# EAGLE design untitled (EAGLE 9.6.2)
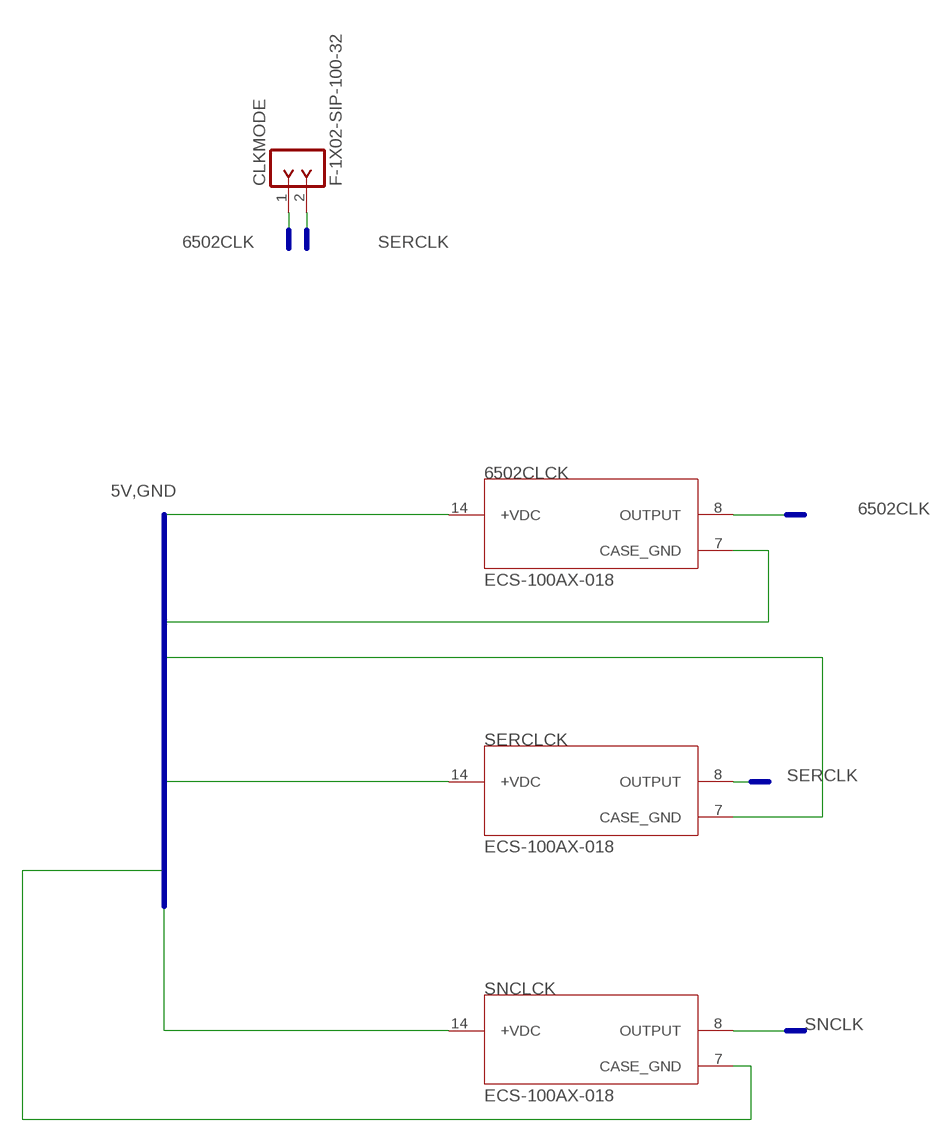
[diagram p0: schematic, sheet 1, part 1 of 3]
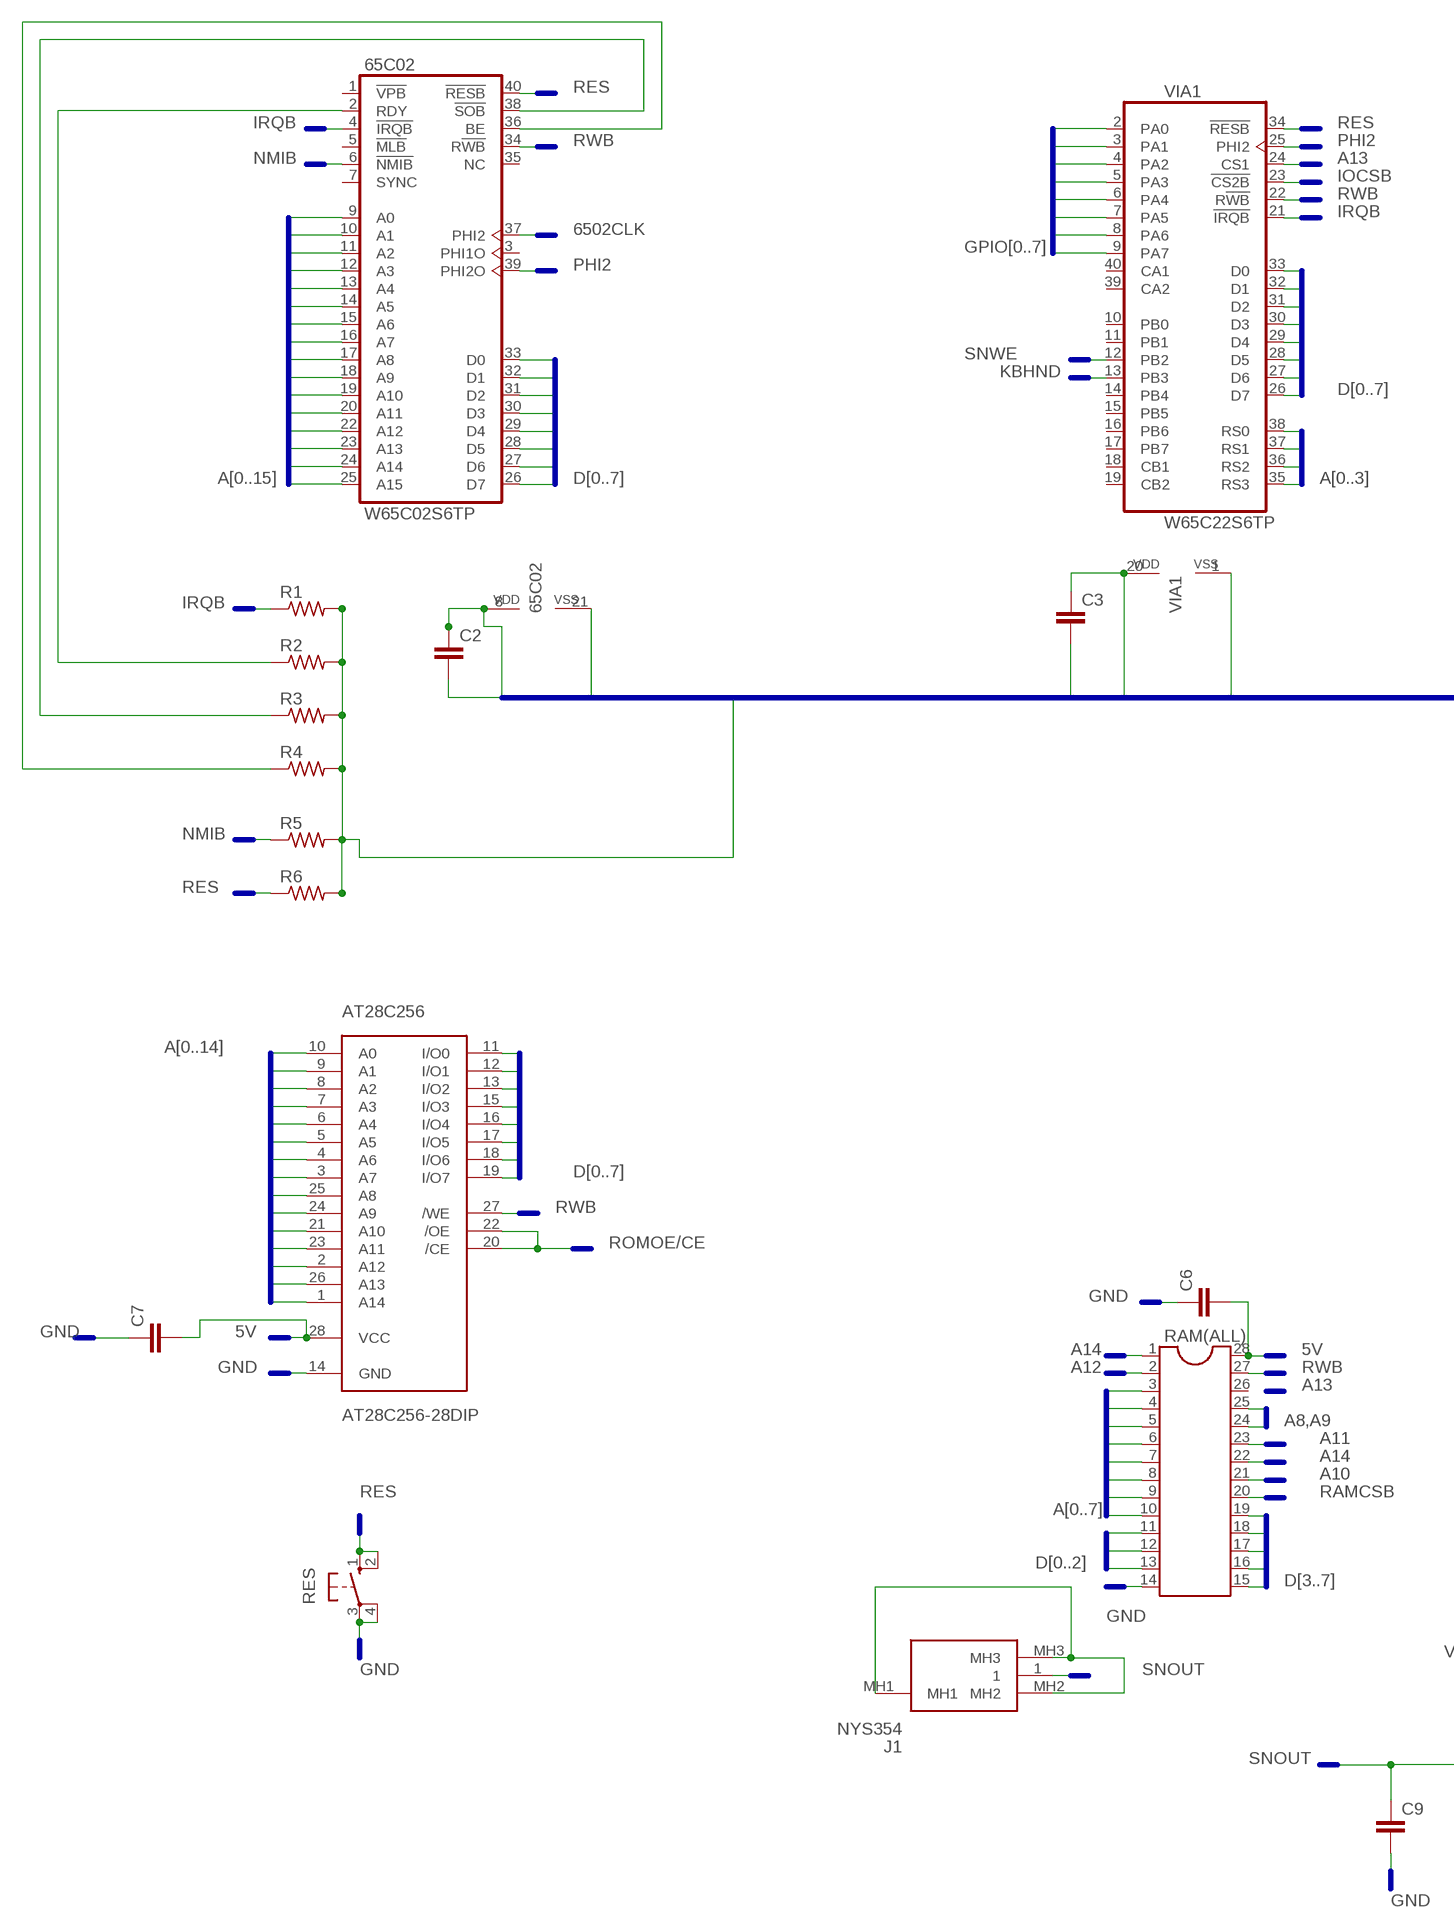
[diagram p1: schematic, sheet 1, part 2 of 3]
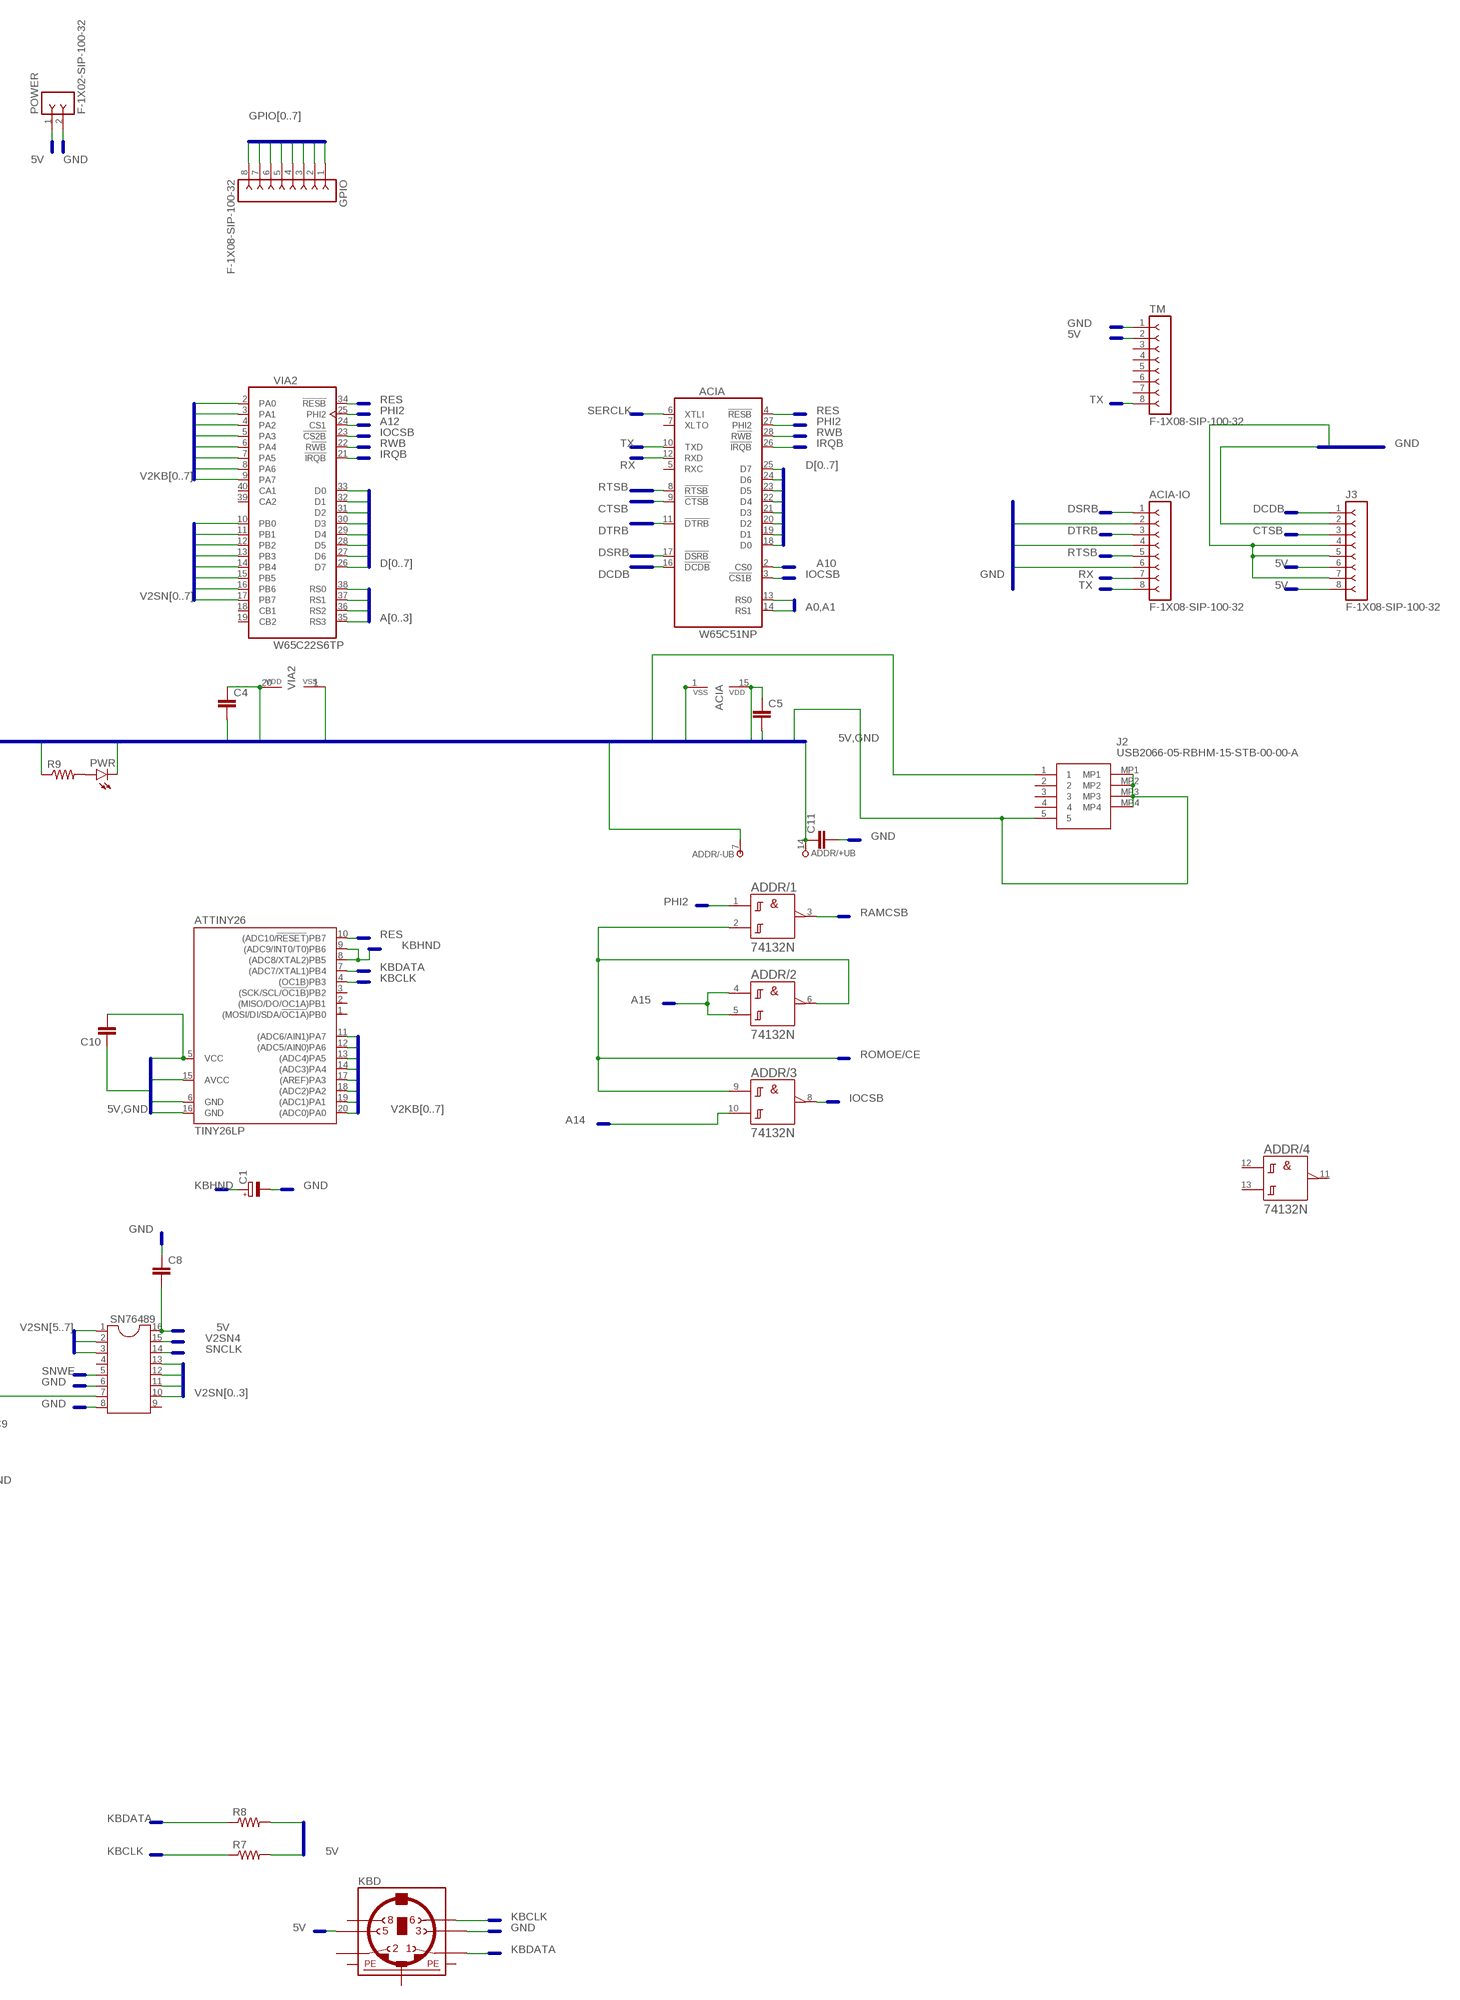
[diagram p2: schematic, sheet 1, part 3 of 3]

## Parts
65C02  W65C02S6TP  [DIL40]
6502CLCK  ECS-100AX-018  [OSC_ECS-100AX-018]
ACIA  W65C51NP  [DIL28-6]
ACIA-IO  F-1X08-SIP-100-32  [SIP-100-08-32]
ADDR  74132N  [DIL14]
AT28C256  AT28C256-28DIP  [DIL28-6]
ATTINY26  TINY26LP  [DIL20]
C1  CPOL-EUE2,5-6E  [E2,5-6E]
C2  C-EU025-024X044  [C025-024X044]
C3  C-EU025-024X044  [C025-024X044]
C4  C-EU025-024X044  [C025-024X044]
C5  C-EU025-024X044  [C025-024X044]
C6  C-EU025-024X044  [C025-024X044]
C7  C-EU025-024X044  [C025-024X044]
C8  C-EU025-024X044  [C025-024X044]
C9  C-EU025-024X044  [C025-024X044]
C10  C-EU025-024X044  [C025-024X044]
C11  C-EU025-024X044  [C025-024X044]
CLKMODE  F-1X02-SIP-100-32  [SIP-100-02-32]
GPIO  F-1X08-SIP-100-32  [SIP-100-08-32]
J1  NYS354  [NYS354]
J2  USB2066-05-RBHM-15-STB-00-00-A  [USB206605RBHM15STB0000A]
J3  F-1X08-SIP-100-32  [SIP-100-08-32]
KBD  MINI_DIN_6  [M_DIN6]
POWER  F-1X02-SIP-100-32  [SIP-100-02-32]
PWR  LED5MM  [LED5MM]
R1  R-US_0204/7  [0204/7]
R2  R-US_0204/7  [0204/7]
R3  R-US_0204/7  [0204/7]
R4  R-US_0204/7  [0204/7]
R5  R-US_0204/7  [0204/7]
R6  R-US_0204/7  [0204/7]
R7  R-US_0204/7  [0204/7]
R8  R-US_0204/7  [0204/7]
R9  R-US_0204/7  [0204/7]
RAM(ALL)  DIL28  [DIL28-6]
RES  10-XX  [B3F-10XX]
SERCLCK  ECS-100AX-018  [OSC_ECS-100AX-018]
SN76489  DIL16  [DIL16]
SNCLCK  ECS-100AX-018  [OSC_ECS-100AX-018]
TM  F-1X08-SIP-100-32  [SIP-100-08-32]
VIA1  W65C22S6TP  [DIL40]
VIA2  W65C22S6TP  [DIL40]

## Nets
5V: 65C02.8(P:VDD) 6502CLCK.14(+VDC) ACIA.15(VDD) ADDR.14(/+UB:+UB) AT28C256.28(VCC) ATTINY26.5(VCC) ATTINY26.15(AVCC) C2.1 C3.1 C4.1 C5.1 C6.2 C7.2 C8.2 C10.2 C11.1 J2.1 J3.6 J3.8 KBD.5 POWER.1 R1.2 R2.2 R3.2 R4.2 R5.2 R6.2 R7.2 R8.2 R9.1 RAM(ALL).28 SERCLCK.14(+VDC) SN76489.16 SNCLCK.14(+VDC) TM.2 VIA1.20(VIAP:VDD) VIA2.20(VIAP:VDD)
6502CLK: 65C02.37(1:PHI2) 6502CLCK.8(OUTPUT) CLKMODE.1
A0: 65C02.9(1:A0) ACIA.13(RS0) AT28C256.10(A0) RAM(ALL).10 VIA1.38(VIA:RS0) VIA2.38(VIA:RS0)
A1: 65C02.10(1:A1) ACIA.14(RS1) AT28C256.9(A1) RAM(ALL).9 VIA1.37(VIA:RS1) VIA2.37(VIA:RS1)
A2: 65C02.11(1:A2) AT28C256.8(A2) RAM(ALL).8 VIA1.36(VIA:RS2) VIA2.36(VIA:RS2)
A3: 65C02.12(1:A3) AT28C256.7(A3) RAM(ALL).7 VIA1.35(VIA:RS3) VIA2.35(VIA:RS3)
A4: 65C02.13(1:A4) AT28C256.6(A4) RAM(ALL).6
A5: 65C02.14(1:A5) AT28C256.5(A5) RAM(ALL).5
A6: 65C02.15(1:A6) AT28C256.4(A6) RAM(ALL).4
A7: 65C02.16(1:A7) AT28C256.3(A7) RAM(ALL).3
A8: 65C02.17(1:A8) AT28C256.25(A8) RAM(ALL).25
A9: 65C02.18(1:A9) AT28C256.24(A9) RAM(ALL).24
A10: 65C02.19(1:A10) ACIA.2(CS0) AT28C256.21(A10) RAM(ALL).21
A11: 65C02.20(1:A11) AT28C256.23(A11) RAM(ALL).23
A12: 65C02.22(1:A12) AT28C256.2(A12) RAM(ALL).2 VIA2.24(VIA:CS1)
A13: 65C02.23(1:A13) AT28C256.26(A13) VIA1.24(VIA:CS1)
A14: 65C02.24(1:A14) ADDR.10(/3:B) AT28C256.1(A14) RAM(ALL).1 RAM(ALL).22
A15: 65C02.25(1:A15) ADDR.4(/2:A) ADDR.5(/2:B)
CTSB: ACIA.9(!CTSB) J3.3
D0: 65C02.33(1:D0) ACIA.18(D0) AT28C256.11(I/O0) RAM(ALL).11 VIA1.33(VIA:D0) VIA2.33(VIA:D0)
D1: 65C02.32(1:D1) ACIA.19(D1) AT28C256.12(I/O1) RAM(ALL).12 VIA1.32(VIA:D1) VIA2.32(VIA:D1)
D2: 65C02.31(1:D2) ACIA.20(D2) AT28C256.13(I/O2) RAM(ALL).13 VIA1.31(VIA:D2) VIA2.31(VIA:D2)
D3: 65C02.30(1:D3) ACIA.21(D3) AT28C256.15(I/O3) RAM(ALL).15 VIA1.30(VIA:D3) VIA2.30(VIA:D3)
D4: 65C02.29(1:D4) ACIA.22(D4) AT28C256.16(I/O4) RAM(ALL).16 VIA1.29(VIA:D4) VIA2.29(VIA:D4)
D5: 65C02.28(1:D5) ACIA.23(D5) AT28C256.17(I/O5) RAM(ALL).17 VIA1.28(VIA:D5) VIA2.28(VIA:D5)
D6: 65C02.27(1:D6) ACIA.24(D6) AT28C256.18(I/O6) RAM(ALL).18 VIA1.27(VIA:D6) VIA2.27(VIA:D6)
D7: 65C02.26(1:D7) ACIA.25(D7) AT28C256.19(I/O7) RAM(ALL).19 VIA1.26(VIA:D7) VIA2.26(VIA:D7)
DCDB: ACIA.16(!DCDB) J3.1
DSRB: ACIA-IO.1 ACIA.17(!DSRB)
DTRB: ACIA-IO.3 ACIA.11(!DTRB)
GND: 65C02.21(P:VSS) 6502CLCK.7(CASE_GND) ACIA-IO.2 ACIA-IO.4 ACIA-IO.6 ACIA.1(VSS) ADDR.7(/-UB:-UB) AT28C256.14(GND) ATTINY26.6(GND) ATTINY26.16(GND) C1.- C2.2 C3.2 C4.2 C5.2 C6.1 C7.1 C8.1 C9.2 C10.1 C11.2 J2.5 J2.MP1 J2.MP2 J2.MP3 J2.MP4 J3.2 J3.4 J3.5 J3.7 KBD.3 POWER.2 PWR.K(C) RAM(ALL).14 RES.3(P) RES.4(P1) SERCLCK.7(CASE_GND) SN76489.6 SN76489.8 SNCLCK.7(CASE_GND) TM.1 VIA1.1(VIAP:VSS) VIA2.1(VIAP:VSS)
GPIO0: GPIO.1 VIA1.2(VIA:PA0)
GPIO1: GPIO.2 VIA1.3(VIA:PA1)
GPIO2: GPIO.3 VIA1.4(VIA:PA2)
GPIO3: GPIO.4 VIA1.5(VIA:PA3)
GPIO4: GPIO.5 VIA1.6(VIA:PA4)
GPIO5: GPIO.6 VIA1.7(VIA:PA5)
GPIO6: GPIO.7 VIA1.8(VIA:PA6)
GPIO7: GPIO.8 VIA1.9(VIA:PA7)
IOCSB: ACIA.3(!CS1B) ADDR.8(/3:Y) VIA1.23(VIA:!CS2B) VIA2.23(VIA:!CS2B)
IRQB: 65C02.4(1:!IRQB) ACIA.26(!IRQB) R1.1 VIA1.21(VIA:!IRQB) VIA2.21(VIA:!IRQB)
KBCLK: ATTINY26.4((OC1B)PB3) KBD.6 R7.1
KBDATA: ATTINY26.7((ADC7/XTAL1)PB4) KBD.1 R8.1
KBHND: ATTINY26.8((ADC8/XTAL2)PB5) ATTINY26.9((ADC9/INT0/T0)PB6) C1.+ VIA1.13(VIA:PB3)
N$1: 65C02.36(1:BE) R4.1
N$2: PWR.A R9.2
N$3: 65C02.2(1:RDY) R2.1
N$4: 65C02.38(1:!SOB) R3.1
N$5: J1.MH1 J1.MH2 J1.MH3
NMIB: 65C02.6(1:!NMIB) R5.1
PHI2: 65C02.39(1:PHI2O) ACIA.27(PHI2) ADDR.1(/1:A) VIA1.25(VIA:PHI2) VIA2.25(VIA:PHI2)
RAMCSB: ADDR.3(/1:Y) RAM(ALL).20
RES: 65C02.40(1:!RESB) ACIA.4(!RESB) ATTINY26.10((ADC10/!RESET!)PB7) R6.1 RES.1(S) RES.2(S1) VIA1.34(VIA:!RESB) VIA2.34(VIA:!RESB)
ROMOE/CE: ADDR.2(/1:B) ADDR.6(/2:Y) ADDR.9(/3:A) AT28C256.20(/CE) AT28C256.22(/OE)
RTSB: ACIA-IO.5 ACIA.8(!RTSB)
RWB: 65C02.34(1:R!WB) ACIA.28(R!WB) AT28C256.27(/WE) RAM(ALL).27 VIA1.22(VIA:R!WB) VIA2.22(VIA:R!WB)
RX: ACIA-IO.7 ACIA.12(RXD)
SERCLK: ACIA.6(XTLI) CLKMODE.2 SERCLCK.8(OUTPUT)
SNCLK: SN76489.14 SNCLCK.8(OUTPUT)
SNOUT: C9.1 J1.1 SN76489.7
SNWE: SN76489.5 VIA1.12(VIA:PB2)
TX: ACIA-IO.8 ACIA.10(TXD) TM.8
V2KB0: ATTINY26.20((ADC0)PA0) VIA2.2(VIA:PA0)
V2KB1: ATTINY26.19((ADC1)PA1) VIA2.3(VIA:PA1)
V2KB2: ATTINY26.18((ADC2)PA2) VIA2.4(VIA:PA2)
V2KB3: ATTINY26.17((AREF)PA3) VIA2.5(VIA:PA3)
V2KB4: ATTINY26.14((ADC3)PA4) VIA2.6(VIA:PA4)
V2KB5: ATTINY26.13((ADC4)PA5) VIA2.7(VIA:PA5)
V2KB6: ATTINY26.12((ADC5/AIN0)PA6) VIA2.8(VIA:PA6)
V2KB7: ATTINY26.11((ADC6/AIN1)PA7) VIA2.9(VIA:PA7)
V2SN0: SN76489.10 VIA2.10(VIA:PB0)
V2SN1: SN76489.11 VIA2.11(VIA:PB1)
V2SN2: SN76489.12 VIA2.12(VIA:PB2)
V2SN3: SN76489.13 VIA2.13(VIA:PB3)
V2SN4: SN76489.15 VIA2.14(VIA:PB4)
V2SN5: SN76489.1 VIA2.15(VIA:PB5)
V2SN6: SN76489.2 VIA2.16(VIA:PB6)
V2SN7: SN76489.3 VIA2.17(VIA:PB7)
Unconnected: 65C02.1(1:!VPB) 65C02.3(1:PHI1O) 65C02.5(1:!MLB) 65C02.7(1:SYNC) 65C02.35(1:NC) ACIA.5(RXC) ACIA.7(XLTO) ADDR.11(/4:Y) ADDR.12(/4:A) ADDR.13(/4:B) ATTINY26.1((MOSI/DI/SDA/!OC1A!)PB0) ATTINY26.2((MISO/DO/OC1A)PB1) ATTINY26.3((SCK/SCL/!OC1B!)PB2) J2.2 J2.3 J2.4 KBD.2 KBD.8 RAM(ALL).26 SN76489.4 SN76489.9 TM.3 TM.4 TM.5 TM.6 TM.7 VIA1.10(VIA:PB0) VIA1.11(VIA:PB1) VIA1.14(VIA:PB4) VIA1.15(VIA:PB5) VIA1.16(VIA:PB6) VIA1.17(VIA:PB7) VIA1.18(VIA:CB1) VIA1.19(VIA:CB2) VIA1.39(VIA:CA2) VIA1.40(VIA:CA1) VIA2.18(VIA:CB1) VIA2.19(VIA:CB2) VIA2.39(VIA:CA2) VIA2.40(VIA:CA1)

## Buses
A[0..15]
D[0..7]
PHI2
5V,GND
RWB
IRQB
RES
NMIB
A[0..3]
A0,A1
TX
RX
RTSB
CTSB
DTRB
DSRB
DCDB
SERCLK
5V
GND
6502CLK
SNCLK
A[0..14]
A[0..7]
A8,A9
A10
A11
A12
A13
A14
D[0..2]
D[3..7]
A15
RAMCSB
IOCSB
ROMOE/CE
V2KB[0..7]
V2SN[0..7]
KBDATA
KBCLK
KBHND
SNWE
GPIO[0..7]
V2SN[0..3]
V2SN4
V2SN[5..7]
SNOUT

## Power pins joined to a net without a drawn wire
PE1: KBD.SH1(PE1)
PE2: KBD.SH2(PE2)
PE3: KBD.SH3(PE3)

## Library data of the parts
65C02 = 6502:W65C02S: W65C02 by WDC
6502CLCK SERCLCK SNCLCK = ECS-100AX-018:ECS-100AX-018: Oscillator 14-DIP, 4 Leads (Full Size, Metal Can) Check prices <https://pricing.snapeda.com/parts/ECS-100AX-018/ECS%20Inc./view-part?ref=eda>; AVAILABILITY: In Stock; DESCRIPTION: 1.8432MHz XO (Standard) TTL Oscillator 5V 14-DIP, 4 Leads (Full Size, Metal Can); MF: ECS Inc.; MP: ECS-100AX-018; PACKAGE: DIP-4 ECS International; PRICE: None; PURCHASE-URL: https://pricing.snapeda.com/search/part/ECS-100AX-018/?ref=eda
ACIA = 6502:W65C51N: W65C51N by WDC
ACIA-IO GPIO J3 TM = con-headers-jp:F-1X08-: FEMALE HEADER
ADDR = 74ttl-din:74*132: Quad 2-input NAND schmitt trigger
AT28C256 = atmel-custom:AT28C256-28DIP: IC EEPROM 256KBIT 150NS 28DIP
ATTINY26 = atmel:TINY26*: 8-bit AVR Microcontroller with 2K Bytes Flash Source: http://www.atmel.com .. doc1477.pdf; MPN: ATTINY26L-8PU; OC_FARNELL: 9171657; OC_NEWARK: 01M6920
C1 = rcl:CPOL-EU: POLARIZED CAPACITOR, European symbol; SPICEPREFIX: C
C2-C11 = rcl:C-EU: CAPACITOR, European symbol; SPICEPREFIX: C
CLKMODE POWER = con-headers-jp:F-1X02-: FEMALE HEADER
J1 = SamacSys_Parts:NYS354: RCA Phono Connectors SHIELDED RIGHT ANGLE REAN Source: Datasheet <http://www.rean-connectors.com/en/products/phono/phono-jacks/nys354>; DESCRIPTION: RCA Phono Connectors SHIELDED RIGHT ANGLE REAN; HEIGHT: 12mm; MANUFACTURER_NAME: Neutrik; MANUFACTURER_PART_NUMBER: NYS354; MOUSER_PART_NUMBER: 568-NYS354; MOUSER_PRICE-STOCK: https://www.mouser.co.uk/ProductDetail/REAN-Neutrik/NYS354?qs=MO8z%252B%252BLepAFDBU89%252BahhOw%3D%3D
J2 = USB2066-05-RBHM-15-STB-00-00-A:USB2066-05-RBHM-15-STB-00-00-A: GCT (GLOBAL CONNECTOR TECHNOLOGY) - USB2066-05-RBHM-15-STB-00-00-A - USB Connector, Mini USB Type B, USB 2.0, Receptacle, 5 Positions, Surface Mount, Right Angle Source: Datasheet; DESCRIPTION: GCT (GLOBAL CONNECTOR TECHNOLOGY) - USB2066-05-RBHM-15-STB-00-00-A - USB Connector, Mini USB Type B, USB 2.0, Receptacle, 5 Positions, Surface Mount, Right Angle; HEIGHT: 4.25mm; MANUFACTURER_NAME: GCT (GLOBAL CONNECTOR TECHNOLOGY); MANUFACTURER_PART_NUMBER: USB2066-05-RBHM-15-STB-00-00-A; MOUSER_PART_NUMBER: 640-2665RBHM15STB00A; MOUSER_PRICE-STOCK: https://www.mouser.co.uk/ProductDetail/GCT/USB2066-05-RBHM-15-STB-00-00-A?qs=KUoIvG%2F9IlZEo87a0wQR%252BA%3D%3D
KBD = mini_din:MINI_DIN_6
PWR = led:LED: LED OSRAM: - CHIPLED LG R971, LG N971, LY N971, LG Q971, LY Q971, LO R971, LY R971 LH N974, LH R974 LS Q976, LO Q976, LY Q976 LO Q996 - Hyper CHIPLED LW Q18S LB Q993, LB Q99A, LB R99A - SideLED LS A670, LO A670, LY A670, LG A670, LP A670 LB A673, LV A673, LT A673, LW A673 LH A674 LY A675 LS A676, LA A676, LO A676, LY A676, LW A676 LS A679, LY A679, LG A679 - Hyper Micro SIDELED® LS Y876, LA Y876, LO Y876, LY Y876 LT Y87S - SmartLED LW L88C, LW L88S LB L89C, LB L89S, LG L890 LS L89K, LO L89K, LY L89K LS L896, LA L896, LO L896, LY L896 - TOPLED LS T670, LO T670, LY T670, LG T670, LP T670 LSG T670, LSP T670, LSY T670, LOP T670, LYG T670 LG T671, LOG T671, LSG T671 LB T673, LV T673, LT T673, LW T673 LH T674 LS T676, LA T676, LO T676, LY T676, LB T676, LH T676, LSB T676, LW T676 LB T67C, LV T67C, LT T67C, LS T67K, LO T67K, LY T67K, LW E67C LS E67B, LA E67B, LO E67B, LY E67B, LB E67C, LV E67C, LT E67C LW T67C LS T679, LY T679, LG T679 LS T770, LO T770, LY T770, LG T770, LP T770 LB T773, LV T773, LT T773, LW T773 LH T774 LS E675, LA E675, LY E675, LS T675 LS T776, LA T776, LO T776, LY T776, LB T776 LHGB T686 LT T68C, LB T68C - Hyper Mini TOPLED® LB M676 - Mini TOPLED Santana® LG M470 LS M47K, LO M47K, LY M47K Source: http://www.osram.convergy.de LUXEON: - LUMILED® LXK2-PW12-R00, LXK2-PW12-S00, LXK2-PW14-U00, LXK2-PW14-V00 LXK2-PM12-R00, LXK2-PM12-S00, LXK2-PM14-U00 LXK2-PE12-Q00, LXK2-PE12-R00, LXK2-PE12-S00, LXK2-PE14-T00, LXK2-PE14-U00 LXK2-PB12-K00, LXK2-PB12-L00, LXK2-PB12-M00, LXK2-PB14-N00, LXK2-PB14-P00, LXK2-PB14-Q00 LXK2-PR12-L00, LXK2-PR12-M00, LXK2-PR14-Q00, LXK2-PR14-R00 LXK2-PD12-Q00, LXK2-PD12-R00, LXK2-PD12-S00 LXK2-PH12-R00, LXK2-PH12-S00 LXK2-PL12-P00, LXK2-PL12-Q00, LXK2-PL12-R00 Source: www.luxeon.com KINGBRIGHT: KA-3528ASYC Source: www.kingbright.com
R1-R9 = rcl:R-US_: RESISTOR, American symbol; SPICEPREFIX: R
RAM(ALL) = ic-package:DIL28: Dual In Line
RES = switch-omron:10-XX: OMRON SWITCH; MPN: B3F-1000; OC_FARNELL: 176432; OC_NEWARK: 36M3542
SN76489 = ic-package:DIL16: Dual In Line / Socket
VIA1 VIA2 = 6502:W65C22S: W65C22 by WDC

## Board
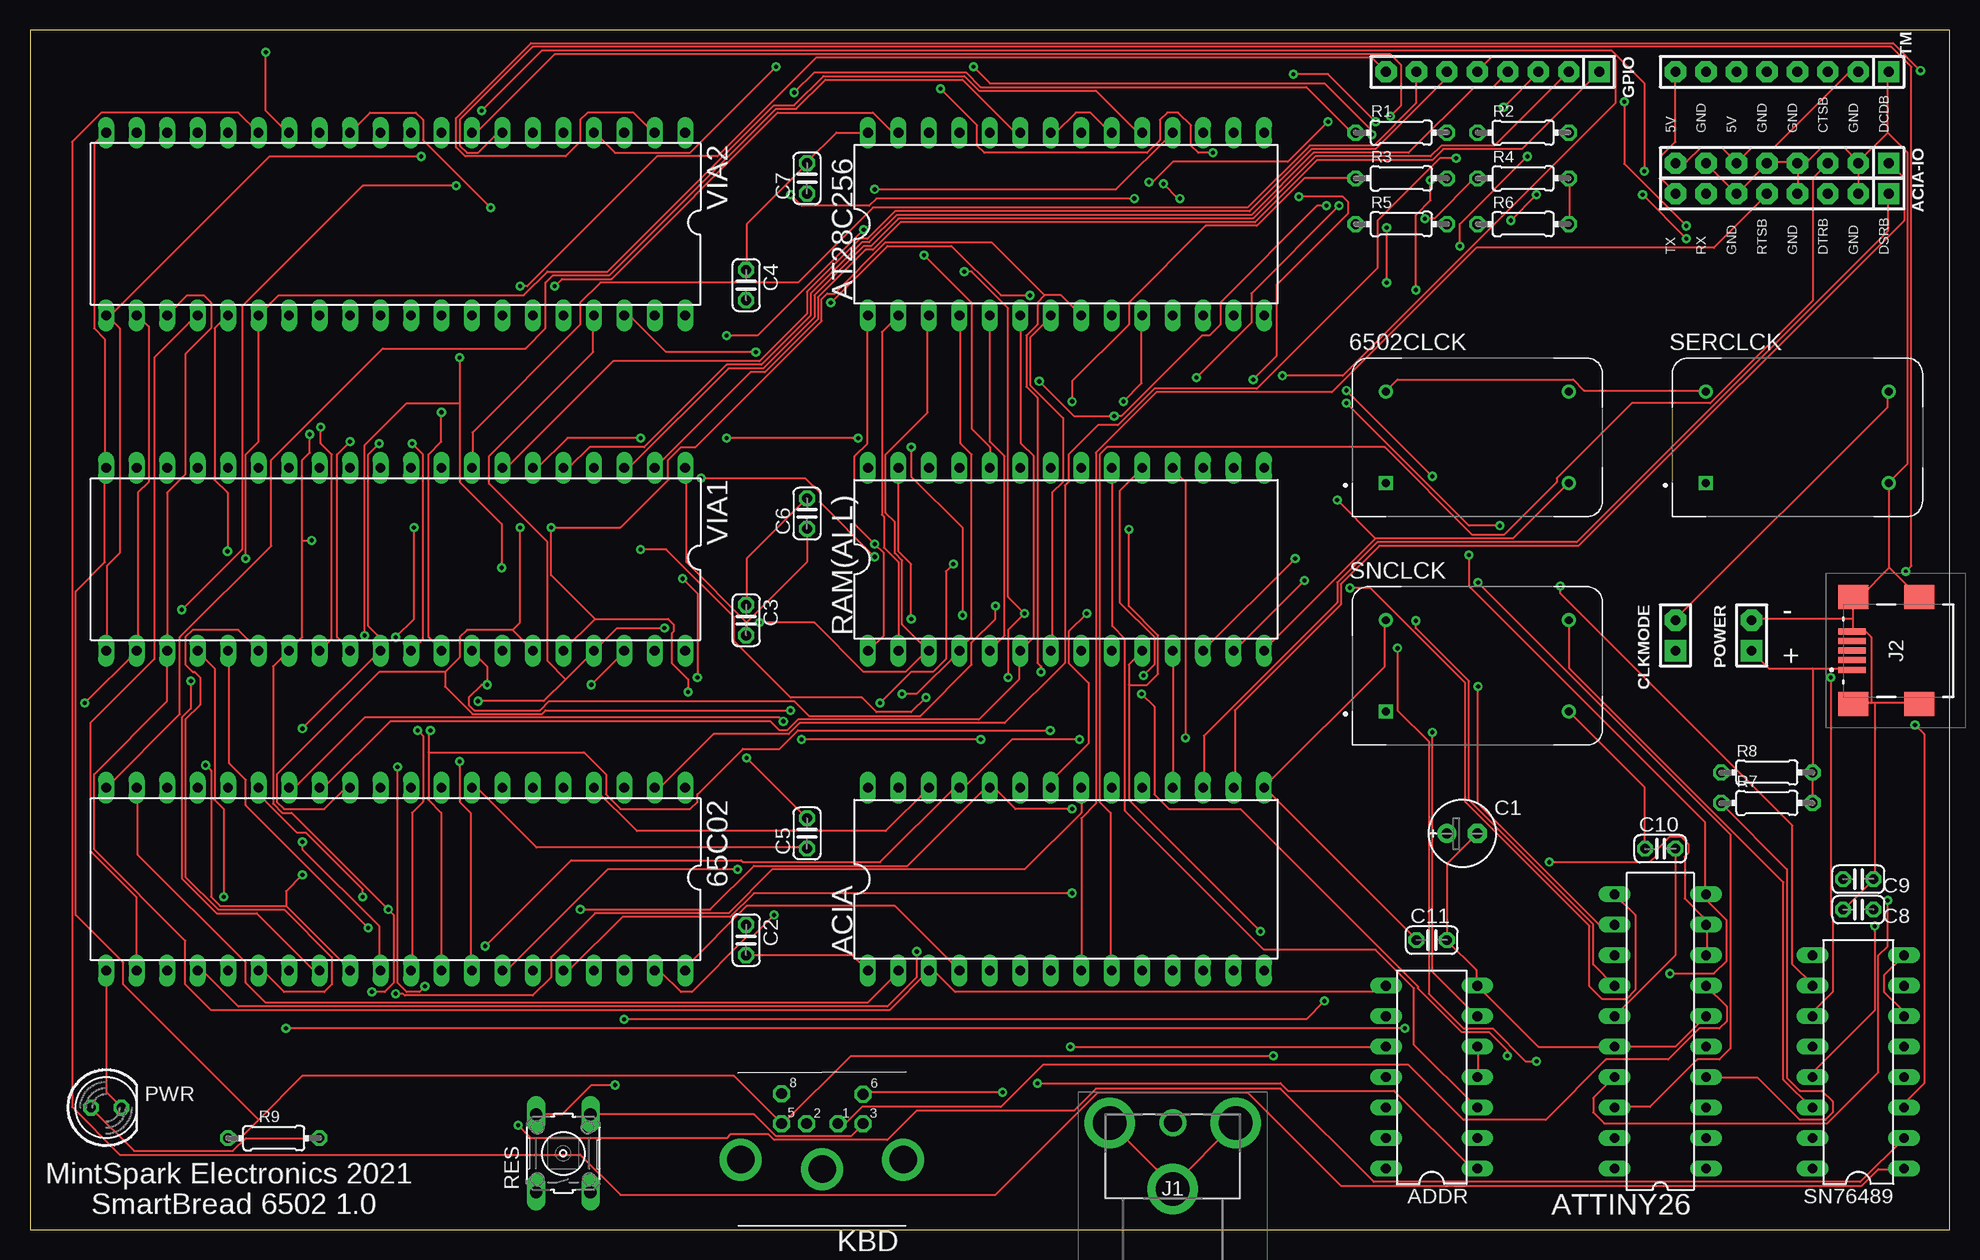
[diagram p3: board, top side]
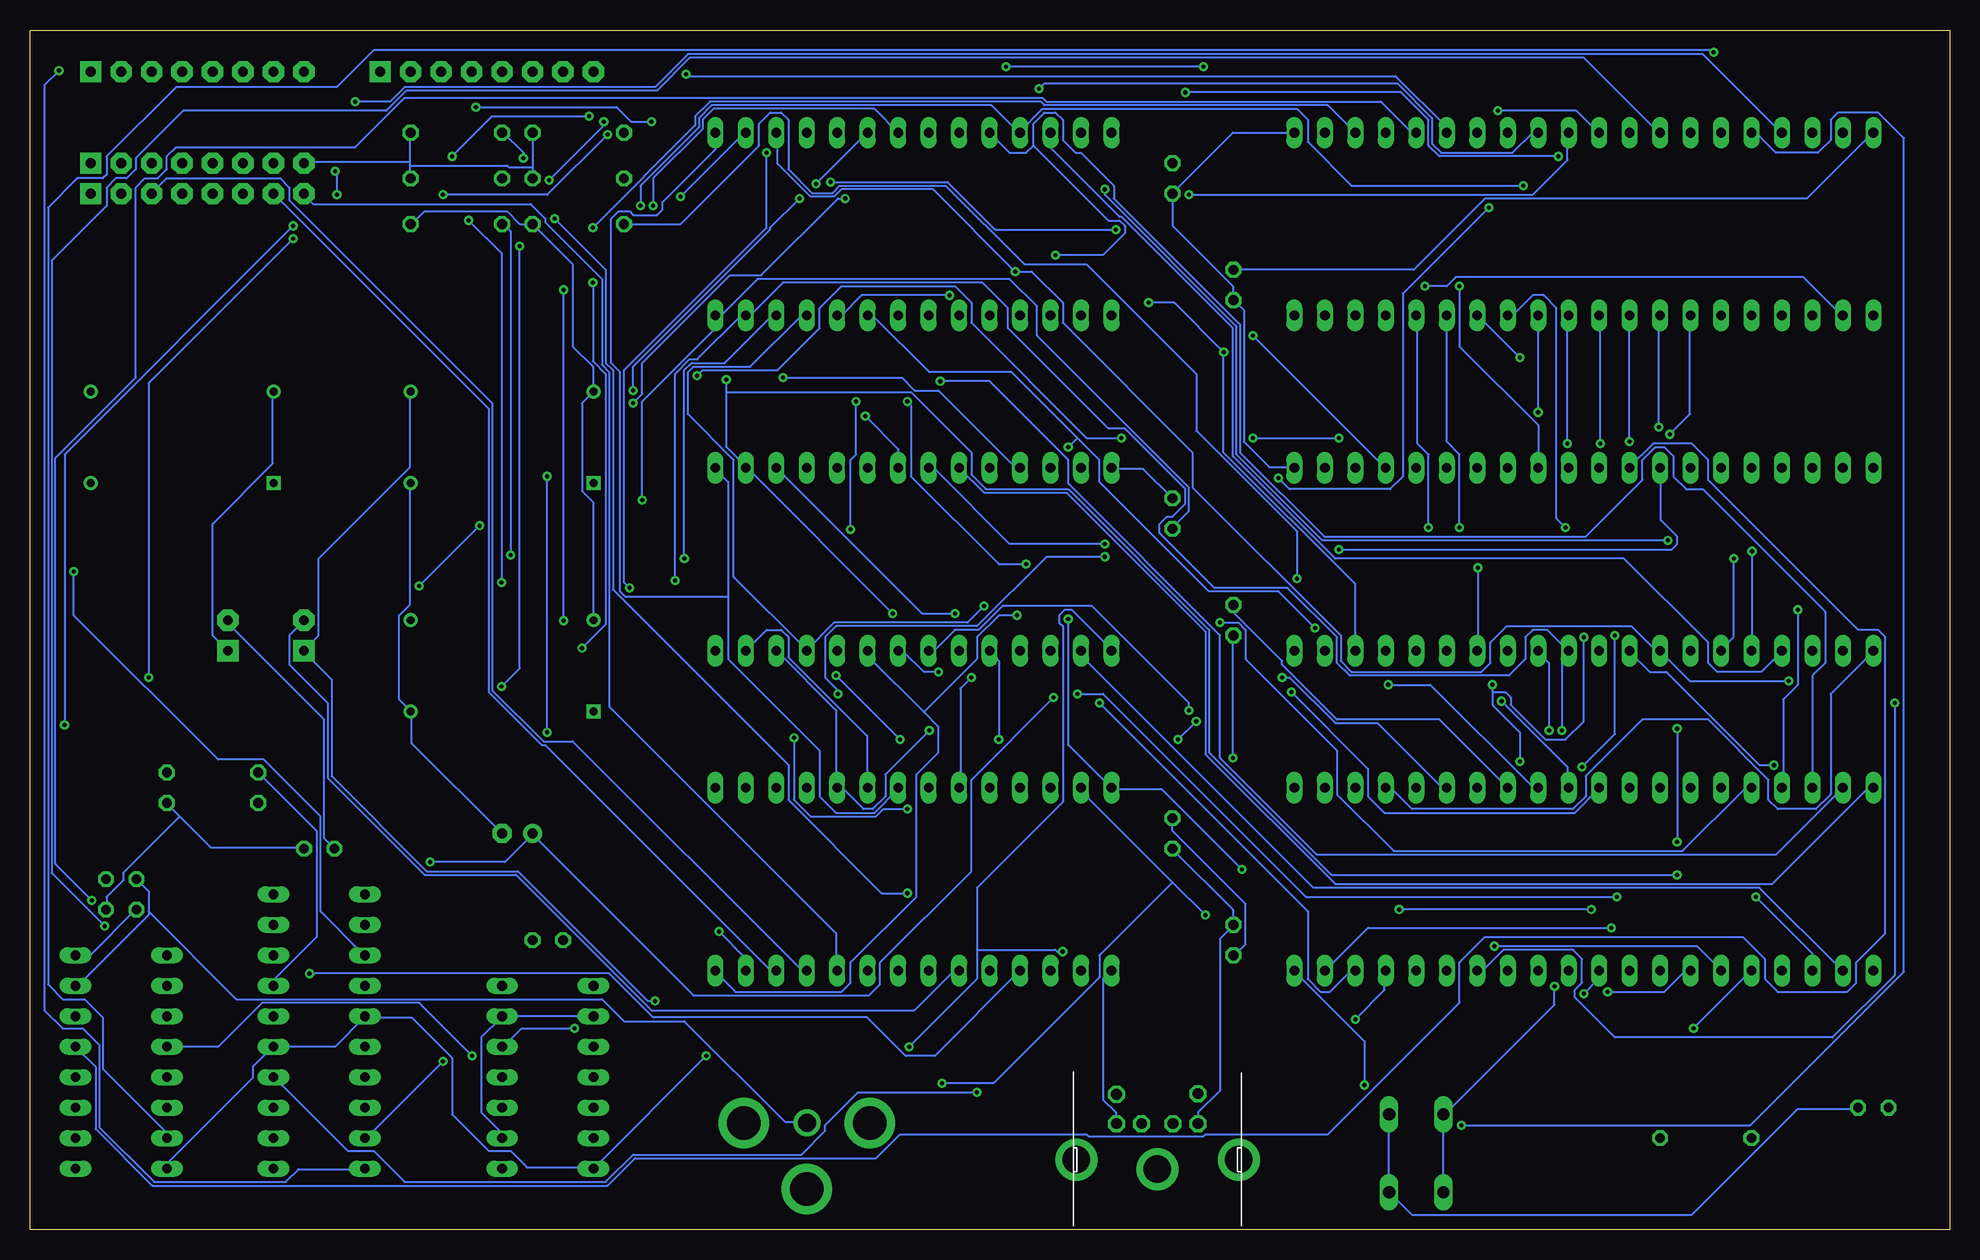
[diagram p4: board, bottom side, seen from below]

Size 160 x 100 mm. Coordinates in mm from the lower left corner, seen from the top.
Outline: 0,0 160,0 160,100 0,100 0,0
Copper layers (1*16): Top 0.035mm / dielectric 1.5mm / Bottom 0.035mm
Design rules "default *": minimum track width 6mil, minimum drill 0.35mm, track to track 6mil, track to pad 10mil, pad to pad 10mil, via to via 10mil, smd to smd 6mil, copper to edge 40mil, drill to drill 6mil, minimum pad ring 10mil, minimum via ring 8mil, stop-mask expansion 4mil, vias tented up to drill 0mil, thermal gap 10mil

### Footprints (pad centres in the part's own frame; a part is rotated, then mirrored left to right if it is on the bottom)
DIL40 = drill 0.813 long: 1 -24.13,-7.62; 2 -21.59,-7.62; 3 -19.05,-7.62; 4 -16.51,-7.62; 5 -13.97,-7.62; 6 -11.43,-7.62; 7 -8.89,-7.62; 8 -6.35,-7.62; 9 -3.81,-7.62; 10 -1.27,-7.62; 11 1.27,-7.62; 12 3.81,-7.62; 13 6.35,-7.62; 14 8.89,-7.62; 15 11.43,-7.62; 16 13.97,-7.62; 17 16.51,-7.62; 18 19.05,-7.62; 19 21.59,-7.62; 20 24.13,-7.62; 21 24.13,7.62; 22 21.59,7.62; 23 19.05,7.62; 24 16.51,7.62; 25 13.97,7.62; 26 11.43,7.62; 27 8.89,7.62; 28 6.35,7.62; 29 3.81,7.62; 30 1.27,7.62; 31 -1.27,7.62; 32 -3.81,7.62; 33 -6.35,7.62; 34 -8.89,7.62; 35 -11.43,7.62; 36 -13.97,7.62; 37 -16.51,7.62; 38 -19.05,7.62; 39 -21.59,7.62; 40 -24.13,7.62
OSC_ECS-100AX-018 = drill 0.65 square: 1 -7.62,-3.81 | drill 0.65: 7 7.62,-3.81; 8 7.62,3.81; 14 -7.62,3.81
DIL28-6 = drill 0.813 long: 1 -16.51,-7.62; 2 -13.97,-7.62; 3 -11.43,-7.62; 4 -8.89,-7.62; 5 -6.35,-7.62; 6 -3.81,-7.62; 7 -1.27,-7.62; 8 1.27,-7.62; 9 3.81,-7.62; 10 6.35,-7.62; 11 8.89,-7.62; 12 11.43,-7.62; 13 13.97,-7.62; 14 16.51,-7.62; 15 16.51,7.62; 16 13.97,7.62; 17 11.43,7.62; 18 8.89,7.62; 19 6.35,7.62; 20 3.81,7.62; 21 1.27,7.62; 22 -1.27,7.62; 23 -3.81,7.62; 24 -6.35,7.62; 25 -8.89,7.62; 26 -11.43,7.62; 27 -13.97,7.62; 28 -16.51,7.62
SIP-100-08-32 = drill 0.813 pad 1.778 square: 1 -8.89,0 | drill 0.813 pad 1.778 octagon: 2 -6.35,0; 3 -3.81,0; 4 -1.27,0; 5 1.27,0; 6 3.81,0; 7 6.35,0; 8 8.89,0
DIL14 = drill 0.813 long: 1 -7.62,-3.81; 2 -5.08,-3.81; 3 -2.54,-3.81; 4 0,-3.81; 5 2.54,-3.81; 6 5.08,-3.81; 7 7.62,-3.81; 8 7.62,3.81; 9 5.08,3.81; 10 2.54,3.81; 11 0,3.81; 12 -2.54,3.81; 13 -5.08,3.81; 14 -7.62,3.81
DIL20 = drill 0.813 long: 1 -11.43,-3.81; 2 -8.89,-3.81; 3 -6.35,-3.81; 4 -3.81,-3.81; 5 -1.27,-3.81; 6 1.27,-3.81; 7 3.81,-3.81; 8 6.35,-3.81; 9 8.89,-3.81; 10 11.43,-3.81; 11 11.43,3.81; 12 8.89,3.81; 13 6.35,3.81; 14 3.81,3.81; 15 1.27,3.81; 16 -1.27,3.81; 17 -3.81,3.81; 18 -6.35,3.81; 19 -8.89,3.81; 20 -11.43,3.81
E2,5-6E = drill 0.813 pad 1.575: + -1.27,0 | drill 0.813 pad 1.575 octagon: - 1.27,0
C025-024X044 = drill 0.813 octagon: 1 -1.27,0; 2 1.27,0
SIP-100-02-32 = drill 0.813 pad 1.778 square: 1 -1.27,0 | drill 0.813 pad 1.778 octagon: 2 1.27,0
NYS354 = drill 1.5 pad 2.25: 1 0,0 | drill 2.8 pad 4.2: MH1 0,5.5; MH2 -5.25,0; MH3 5.25,0
USB206605RBHM15STB0000A = smd 0.5 x 2.3: 1 -1.6,5.6; 2 -0.8,5.6; 3 0,5.6; 4 0.8,5.6; 5 1.6,5.6 | smd 2 x 2.5: MP1 -4.45,5.5; MP2 4.45,5.5; MP3 4.45,0; MP4 -4.45,0
M_DIN6 = drill 0.9 pad 1.422 octagon: 1 -1.3,-3.75; 2 1.3,-3.75; 3 -3.4,-3.75; 5 3.4,-3.75; 6 -3.4,-6.2; 8 3.4,-6.25 | drill 2.3 pad 3.5: SH1 6.8,-0.75; SH2 0,0.05; SH3 -6.75,-0.75
LED5MM = drill 0.813 octagon: A -1.27,0; K 1.27,0
0204/7 = drill 0.813 octagon: 1 -3.81,0; 2 3.81,0
B3F-10XX = drill 1.016 long: 1 -3.251,2.261; 2 3.251,2.261; 3 -3.251,-2.261; 4 3.251,-2.261
DIL16 = drill 0.813 long: 1 -8.89,-3.81; 2 -6.35,-3.81; 3 -3.81,-3.81; 4 -1.27,-3.81; 5 1.27,-3.81; 6 3.81,-3.81; 7 6.35,-3.81; 8 8.89,-3.81; 9 8.89,3.81; 10 6.35,3.81; 11 3.81,3.81; 12 1.27,3.81; 13 -1.27,3.81; 14 -3.81,3.81; 15 -6.35,3.81; 16 -8.89,3.81

### Placement (x,y rotation side)
65C02  30.48,29.21 180 top
6502CLCK  120.65,66.04 0 top
ACIA  86.36,29.21 0 top
ACIA-IO  146.05,86.36 180 top
ADDR  116.84,12.7 90 top
AT28C256  86.36,83.82 0 top
ATTINY26  135.89,16.51 90 top
C1  119.38,33.02 0 top
C2  59.69,24.13 270 top
C3  59.69,50.8 270 top
C4  59.69,78.74 270 top
C5  64.77,33.02 90 top
C6  64.77,59.69 90 top
C7  64.77,87.63 90 top
C8  152.4,26.67 0 top
C9  152.4,29.21 0 top
C10  135.89,31.75 0 top
C11  116.84,24.13 0 top
CLKMODE  137.16,49.53 90 top
GPIO  121.92,96.52 180 top
J1  95.25,8.89 180 top
J2  157.48,48.26 90 top
J3  146.05,88.9 180 top
KBD  66.04,5.08 180 top
POWER  143.51,49.53 90 top
PWR  6.35,10.16 0 top
R1  114.3,91.44 0 top
R2  124.46,91.44 0 top
R3  114.3,87.63 0 top
R4  124.46,87.63 0 top
R5  114.3,83.82 0 top
R6  124.46,83.82 0 top
R7  144.78,35.56 0 top
R8  144.78,38.1 0 top
R9  20.32,7.62 0 top
RAM(ALL)  86.36,55.88 0 top
RES  44.45,6.35 90 top
SERCLCK  147.32,66.04 0 top
SN76489  152.4,13.97 90 top
SNCLCK  120.65,46.99 0 top
TM  146.05,96.52 180 top
VIA1  30.48,55.88 180 top
VIA2  30.48,83.82 180 top

### Tracks (layer width: path | path; a pad name or v marks a point on that pad's centre or on a via)
5V  (via drill 0.35)
  Top 0.152: R7.2 R8.2 148.59,46.79 | 148.59,46.79 144.93,46.79 143.56,48.16 POWER.1 | 148.59,46.79 151.79,46.79 J2.1 | ATTINY26.15 137.16,22.86 C10.2 | 102.87,36.88 112.93,46.94 112.93,50.75 SNCLCK.14 | 102.87,36.88 115.52,24.23 C11.1 | 102.87,36.88 ACIA.15 | R6.2 128.32,83.82 128.32,87.63 R4.2 | J3.8 137.16,89 138.07,89 139.29,90.22 140.97,90.22 142.19,89 J3.6 143.56,90.22 145.39,90.22 151.64,96.47 152.4,96.47 TM.2 | SERCLCK.14 139.6,69.95 129.54,69.95 128.63,70.87 114,70.87 113.08,69.95 6502CLCK.14 | C4.1 59.74,80.01 59.74,83.82 64.77,88.85 C7.2 64.77,89 67.21,91.44 AT28C256.28 | VIA2.20 6.25,91.44 5.33,90.53 5.33,75.13 6.25,74.22 6.25,63.55 VIA1.20 6.25,63.4 6.25,55.63 3.81,53.19 3.81,26.21 7.77,22.25 7.77,20.42 19.05,9.14 | R9.1 17.53,7.62 19.05,9.14 | 19.05,9.14 22.71,12.8 58.67,12.8 KBD.5 62.79,8.84 68.43,14.48 v103.63,14.48 | C6.2 59.74,55.93 59.74,52.12 C3.1 | 65C02.8 36.88,36.73 37.34,36.73 42.22,31.85 64.77,31.85 C5.1
  Bottom 0.152: SN76489.16 148.59,5.49 141.43,12.65 141.43,13.56 139.75,15.24 ATTINY26.5 134.57,15.24 132.13,17.68 ATTINY26.15 131.98,17.68 128.17,17.68 124.82,14.33 124.82,9.6 121.77,6.55 119.94,6.55 118.57,5.18 113.08,5.18 ADDR.14 v103.63,14.48 | 147.52,34.44 148.59,35.51 R7.2 | 147.52,34.44 144.93,31.85 137.16,31.85 C10.2 | 147.52,34.44 152.25,29.72 152.25,29.11 153.62,27.74 153.62,26.67 C8.2 | POWER.1 144.78,49.53 144.78,58.83 139.75,63.86 139.75,69.8 SERCLCK.14 | R1.2 118.11,88.54 | 118.11,88.54 R3.2 | 128.32,88.7 128.32,87.63 R4.2 | 128.32,88.7 128.32,89 | 128.32,89 128.32,91.44 R2.2 | 118.11,88.54 120.09,88.54 120.24,88.7 128.32,88.7 | 128.32,89 137.16,89 J3.8 | R6.2 128.17,83.82 127.1,84.89 120.24,84.89 119.18,83.82 R5.2 114.76,80.47 114.76,73.61 113.08,71.93 113.08,69.95 6502CLCK.14 114,68.89 114,61.57 113.08,60.66 113.08,50.9 SNCLCK.14 | C4.1 44.65,80.01 38.71,85.95 11.89,85.95 6.4,91.44 VIA2.20 | C6.2 67.21,63.4 69.8,63.4 RAM(ALL).28 | C5.1 64.77,31.7 59.74,26.67 59.74,25.45 C2.1 59.74,25.3 60.81,24.23 60.81,11.58 62.64,9.75 KBD.5 | 65C02.8 42.52,42.52 51.05,42.52 55.63,47.09 55.63,47.4 59.59,51.36 59.59,51.97 C3.1
6502CLK  (via drill 0.35)
  Top 0.152: v49.53,17.53 106.38,17.53 v107.9,19.05
  Bottom 0.152: 6502CLCK.8 128.32,69.8 128.32,63.55 135.94,55.93 135.94,49.53 137.16,48.31 CLKMODE.1 137.16,48.16 134.87,45.87 134.87,37.8 126.95,29.87 119.33,29.87 108.51,19.05 v107.9,19.05 | v49.53,17.53 47.09,19.96 47.09,21.49 65C02.37
A0  (via drill 0.35)
  Top 0.152: v102.56,24.84 91.59,35.81 91.59,45.41 | 91.59,45.41 91.59,47.09 92.66,48.16 RAM(ALL).10 | v91.14,69.04 92.66,70.56 92.66,76.2 AT28C256.10 | v91.59,58.37 91.59,51.97 94.03,49.53 94.03,46.33 93.12,45.41 91.59,45.41 | v46.79,45.41 49.53,48.16 VIA1.38 | VIA2.38 49.99,76.2 53.03,73.15 v60.5,73.15 | v83.36,77.88 80.92,77.88 76.81,81.99 71.48,81.99 v66.75,77.27
  Bottom 0.152: v102.56,24.84 100.43,22.71 100.43,21.64 ACIA.13 | v91.14,69.04 91.14,64.62 91.59,64.16 v91.59,58.37 | v46.79,45.41 43.28,45.41 34.75,36.88 34.29,36.88 65C02.9 | VIA1.38 49.53,53.8 60.5,64.77 v60.5,73.15 64.62,77.27 v66.75,77.27 | AT28C256.10 92.35,76.2 90.68,77.88 v83.36,77.88
A1  (via drill 0.35)
  Top 0.152: v37.34,44.04 42.82,44.04 44.65,45.87 | 44.65,45.87 46.94,48.16 VIA1.37 47.09,48.31 48.92,50.14 v52.88,50.14 | 44.65,45.87 43.13,47.4 43.13,57.3 38.25,62.18 38.25,64.47 46.94,73.15 46.94,76.2 VIA2.37 | v77.72,51.21 77.72,58.52 73.46,62.79 v73.46,65.23
  Bottom 0.152: 85.5,43.13 84.28,41.91 84.28,39.78 86.11,37.95 86.11,27.74 91.59,22.25 91.59,20.57 92.35,19.81 101.19,19.81 102.87,21.49 ACIA.14 | 85.5,43.13 90.07,47.7 90.07,48.16 RAM(ALL).9 | v37.34,44.04 31.85,38.56 31.85,36.88 65C02.10 | AT28C256.9 89.76,76.2 85.04,71.48 78.18,71.48 72.69,65.99 | 72.69,65.99 70.87,64.16 70.87,62.33 61.72,53.19 55.93,53.19 v52.88,50.14 | 85.5,43.13 81.08,47.55 81.08,49.38 79.25,51.21 v77.72,51.21 | 72.69,65.99 v73.46,65.23
A2  (via drill 0.35)
  Top 0.152: v84.28,46.48 84.28,46.94 83.97,47.24 83.97,69.34 83.06,70.26 83.06,74.52 83.97,75.44 83.97,77.27 84.58,77.88 | 84.58,77.88 85.95,77.88 AT28C256.8 | v54.86,44.81 54.86,45.87 53.49,47.24 53.49,49.68 53.65,49.84 53.65,50.44 53.19,50.9 47.09,50.9 | VIA1.36 47.09,50.9 | 47.09,50.9 43.43,54.56 v43.43,58.52 49.23,58.52 53.19,62.48 53.19,64.16 54.25,65.23 55.47,65.23 65.99,75.74 65.99,77.57 66.45,78.03 67.06,78.03 71.32,82.3 80.16,82.3 84.58,77.88
  Bottom 0.152: v84.28,46.48 85.5,46.48 87.17,48.16 87.63,48.16 RAM(ALL).8 | v54.86,44.81 48.46,38.41 48.46,36.12 47.09,34.75 31.24,34.75 29.26,36.73 65C02.11 | v43.43,58.52 43.43,64.62 44.35,65.53 44.35,76.2 VIA2.36
A3  (via drill 0.35)
  Top 0.152: RAM(ALL).7 85.19,48.31 85.19,61.42 86.11,62.33 86.11,67.67 83.36,70.41 83.36,74.37 85.19,76.2 AT28C256.7 | 34.59,46.48 29.11,46.48 20.57,37.95 20.57,35.66 21.18,35.05 24.54,35.05 26.21,36.73 26.67,36.73 65C02.12 | 34.59,46.48 35.81,47.7 35.81,49.38 36.42,49.99 40.23,49.99 | 40.23,49.99 41.91,48.31 VIA1.35 | v40.84,58.52 40.84,50.6 40.23,49.99 | v63.4,43.28 42.98,43.28 42.67,42.98 36.88,42.98 34.59,45.26 34.59,46.48
  Bottom 0.152: VIA2.35 41.91,65.68 40.84,64.62 v40.84,58.52 | v63.4,43.28 63.4,43.89 71.48,51.97 78.94,51.97 80.92,49.99 82.91,49.99 84.58,48.31 85.04,48.31 RAM(ALL).7
A4
  Top 0.152: 65C02.13 24.23,36.88 24.54,36.88 30.02,42.37 61.72,42.37 62.48,41.6 63.09,41.6 64.01,42.52 79.1,42.52 82.45,45.87 82.45,48.16 RAM(ALL).6 83.67,49.38 83.67,64.47 82.6,65.53 82.6,76.2 AT28C256.6
A5  (via drill 0.35)
  Top 0.152: v62.79,42.37 62.48,42.67 27.89,42.67 22.1,36.88 21.64,36.88 65C02.14 | v79.25,40.84 v64.31,40.84 | AT28C256.5 80.01,65.68 81.23,64.47 81.23,49.53 80.01,48.31 RAM(ALL).5
  Bottom 0.152: v64.31,40.84 v62.79,42.37 | v79.25,40.84 79.25,47.4 80.01,48.16 RAM(ALL).5
A6  (via drill 0.35)
  Top 0.152: 65C02.15 19.05,36.27 22.25,33.07 23.01,33.07 27.74,28.35 v27.74,27.74 | v72.69,44.65 73.91,44.65 77.42,48.16 RAM(ALL).4 77.42,48.31 78.49,49.38 78.49,64.62 77.57,65.53 77.57,76.2 AT28C256.4
  Bottom 0.152: v27.74,27.74 53.65,27.74 70.56,44.65 v72.69,44.65
A7  (via drill 0.35)
  Top 0.152: v60.81,50.6 65.38,50.6 69.49,46.48 73,46.48 74.83,48.31 | 74.83,48.31 72.69,50.44 72.69,55.78 72.08,56.39 72.08,58.98 71.32,59.74 71.32,64.62 74.83,68.12 74.83,76.2 AT28C256.3 | 74.83,48.31 RAM(ALL).3
  Bottom 0.152: v60.81,50.6 59.28,50.6 58.67,49.99 58.67,47.55 51.05,39.93 51.05,36.27 46.33,31.55 22.25,31.55 17.07,36.73 16.61,36.73 65C02.16
A8  (via drill 0.35)
  Top 0.152: v12.65,51.66 17.68,56.69 17.68,76.96 27.74,87.02 v35.51,87.02 | v97.23,71.02 101.8,75.59 101.8,78.03 v109.12,85.34
  Bottom 0.152: v12.65,51.66 12.65,45.41 13.87,44.2 13.87,36.88 65C02.17 | v35.51,87.02 49.84,87.02 53.49,90.68 53.49,92.51 54.41,93.42 75.59,93.42 77.57,91.44 | v97.23,71.02 87.33,71.02 86.26,69.95 84.28,69.95 77.88,63.55 77.57,63.55 RAM(ALL).25 | v109.12,85.34 109.12,87.02 104.24,91.9 104.24,92.66 103.17,93.73 79.86,93.73 77.57,91.44 | 77.57,91.44 AT28C256.25
A9  (via drill 0.35)
  Top 0.152: RAM(ALL).24 80.01,65.23 78.49,66.75 78.49,77.27 v74.52,81.23
  Bottom 0.152: 65C02.18 11.43,46.18 10.36,47.24 10.36,51.51 20.57,61.72 21.95,61.72 23.01,62.79 23.01,64.47 23.77,65.23 24.54,65.23 25.6,64.16 25.6,62.48 30.33,57.76 52.12,57.76 59.13,64.77 59.13,75.44 69.65,85.95 69.65,87.02 72.39,89.76 72.85,89.76 73.91,90.83 73.91,92.51 74.52,93.12 75.44,93.12 76.35,92.2 76.35,90.37 | 76.35,90.37 76.96,89.76 78.33,89.76 AT28C256.24 | v74.52,81.23 70.56,81.23 68.73,83.06 68.73,83.67 69.19,84.12 70.1,84.12 76.35,90.37
A10  (via drill 0.35)
  Top 0.152: v108.05,85.34 107.29,85.34 99.21,77.27 99.21,75.44 98.3,74.52 97.69,74.52 90.98,67.82 v90.37,67.82 87.02,67.82 v84.12,70.71 | 65C02.19 8.99,36.73 8.99,31.24 17.98,22.25 17.98,20.57 19.66,18.9 69.8,18.9 72.39,21.49 ACIA.2
  Bottom 0.152: RAM(ALL).21 87.63,65.08 v90.37,67.82 | v108.05,85.34 108.05,87.63 103.94,91.75 103.94,92.51 103.02,93.42 89.61,93.42 AT28C256.21 | v84.12,70.71 80.01,70.71 73.46,64.16 73.46,62.18 60.81,49.53 60.81,39.32 52.73,31.24 14.48,31.24 65C02.19
A11
  Top 0.152: AT28C256.23 82.14,91.44 77.72,95.86 66.29,95.86 63.86,93.42 62.18,93.42 48.31,79.55 43.59,79.55 42.98,78.94 42.98,75.13 41.3,73.46 29.41,73.46 20.12,64.16 20.12,57 12.5,49.38 12.5,42.98 65C02.20
  Bottom 0.152: RAM(ALL).23 80.47,61.42 73.61,61.42 62.03,49.84 62.03,39.62 51.21,28.8 14.78,28.8 6.86,36.73 6.4,36.73 65C02.20
A12
  Top 0.152: RAM(ALL).2 72.39,55.63 71.17,56.84 71.17,59.44 71.02,59.59 71.02,74.83 AT28C256.2 | 65C02.22 8.84,21.64 8.84,27.74 5.03,31.55 5.03,42.22 10.36,47.55 10.36,72.69 13.87,76.2 VIA2.24
  Bottom 0.152: RAM(ALL).2 72.39,47.85 53.03,28.5 15.85,28.5 8.99,21.64 65C02.22
A13  (via drill 0.35)
  Top 0.152: v16.15,27.74 16.15,35.05 15.39,35.81 15.39,46.79 14.02,48.16 VIA1.24
  Bottom 0.152: 65C02.23 11.43,23.01 v16.15,27.74 | AT28C256.26 74.83,91.44 74.83,90.07 69.19,84.43 69.04,84.43 59.74,75.13 59.74,64.47 51.21,55.93 27.13,55.93 20.12,48.92 20.12,47.24 19.36,46.48 15.7,46.48 14.02,48.16 VIA1.24
A14  (via drill 0.35)
  Top 0.152: v86.72,15.24 ADDR.10 | v73.91,23.16 73.91,21.03 71.48,18.59 17.37,18.59 14.48,21.49 14.02,21.49 65C02.24 | AT28C256.1 69.8,76.2 69.8,65.53 68.73,64.47 68.73,58.83 v70.41,57.15 71.17,56.39 71.17,49.53 69.95,48.31 RAM(ALL).1
  Bottom 0.152: v86.72,15.24 81.08,20.88 81.08,23.32 | 81.08,23.32 81.08,28.5 73.91,35.66 73.91,50.29 74.22,50.6 74.22,51.21 73.76,51.66 73.15,51.66 69.8,48.31 RAM(ALL).1 | v73.91,23.16 74.37,23.16 74.52,23.32 81.08,23.32 | v70.41,57.15 78.33,57.15 84.58,63.4 85.04,63.4 RAM(ALL).22
A15  (via drill 0.35)
  Top 0.152: v114.61,16.76 v21.34,16.76 | ADDR.4 120.7,12.8 120.7,15.24 ADDR.5
  Bottom 0.152: v21.34,16.76 65C02.25 | v114.61,16.76 119.02,16.76 120.55,15.24 ADDR.5
CTSB
  Top 0.152: J3.3 148.59,87.63 148.59,77.42 140.06,68.89 133.5,68.89 127.25,62.64 127.25,62.33 122.83,57.91 120.24,57.91 112.93,65.23 89.76,65.23 89.15,64.62 89.15,35.66 90.07,34.75 90.07,21.64 ACIA.9
D0  (via drill 0.35)
  Top 0.152: RAM(ALL).11 ACIA.18 | v35.81,39.01 35.81,35.66 36.73,34.75 36.73,21.64 65C02.33 | VIA1.33 36.88,48.16 38.1,46.94 v38.1,45.41 37.64,45.41 36.58,44.35 36.58,43.74 37.03,43.28 42.52,43.28 43.28,44.04 63.7,44.04 64.92,42.82 74.22,42.82 78.49,47.09 78.49,48.92 80.47,50.9 v80.47,51.97 | v32,58.52 32,50.9 v30.48,49.38
  Bottom 0.152: AT28C256.11 95.71,76.2 99.97,71.93 104.7,71.93 105.16,71.48 105.16,67.97 101.35,64.16 101.35,54.41 95.25,48.31 | v35.81,39.01 35.81,41.45 38.1,43.74 38.1,44.81 | v38.1,45.41 38.1,44.81 | VIA2.33 36.42,76.2 34.75,77.88 33.83,77.88 32.77,76.81 32.77,59.28 v32,58.52 | v30.48,49.38 30.48,42.37 32,40.84 33.68,40.84 36.58,43.74 36.58,44.35 37.03,44.81 38.1,44.81 | 95.25,48.31 92.96,50.6 81.84,50.6 v80.47,51.97 | 95.25,48.31 RAM(ALL).11
D1  (via drill 0.35)
  Top 0.152: RAM(ALL).12 v105.46,55.93 | 65C02.32 34.29,34.75 33.22,35.81 33.22,39.78 | 33.22,39.78 33.22,41.45 v33.38,41.6 | v34.29,68.12 34.29,65.68 33.22,64.62 33.22,49.38 34.29,48.31 VIA1.32 | v85.04,41.6 64.01,41.6 62.48,40.08 59.44,40.08 55.63,36.27 55.63,35.66 55.02,35.05 49.23,35.05 48.01,36.27 48.01,37.95 46.18,39.78 33.22,39.78
  Bottom 0.152: RAM(ALL).12 92.81,43.28 92.81,36.88 ACIA.19 92.66,36.73 92.2,36.73 90.53,35.05 89.76,35.05 88.7,36.12 88.7,37.95 v85.04,41.6 | AT28C256.12 98.15,76.2 102.11,72.24 104.85,72.24 105.46,71.63 v105.46,55.93 | v33.38,41.6 33.38,47.24 34.29,48.16 VIA1.32 | v34.29,68.12 VIA2.32
D2  (via drill 0.35)
  Top 0.152: v106.22,54.1 100.43,48.31 RAM(ALL).13 | v32.31,41.6 32.77,41.15 32.77,35.66 31.85,34.75 31.85,21.64 65C02.31 | v31.85,65.53 32.77,64.62 32.77,49.23 31.85,48.31 VIA1.31
  Bottom 0.152: RAM(ALL).13 98.6,49.99 97.38,49.99 96.77,49.38 96.77,47.7 90.22,41.15 90.22,36.88 ACIA.20 | v106.22,54.1 106.22,71.32 105,72.54 104.39,72.54 100.74,76.2 AT28C256.13 99.97,76.2 97.23,78.94 80.62,78.94 78.49,76.81 78.49,75.13 70.1,66.75 68.73,66.75 63.7,61.72 63.7,60.5 64.77,59.44 65.23,59.44 65.84,58.83 65.84,58.06 61.27,53.49 55.17,53.49 51.05,49.38 51.05,47.24 49.99,46.18 36.73,46.18 35.36,47.55 35.36,49.38 34.75,49.99 33.53,49.99 31.85,48.31 VIA1.31 32.31,47.7 v32.31,41.6 | v31.85,65.53 31.85,76.2 VIA2.31
D3  (via drill 0.35)
  Top 0.152: v22.71,32.31 22.71,31.7 29.11,25.3 29.11,21.64 65C02.30 | v22.71,41.76 VIA1.30 29.11,48.31 29.11,49.38 28.19,50.29 28.19,64.62 v29.11,65.53 | v30.48,19.66 31.09,19.66 31.24,19.51 41.91,19.51 43.43,21.03 43.43,22.71 47.09,26.36 58.22,26.36 61.87,30.02 82.91,30.02 87.63,34.75 ACIA.21
  Bottom 0.152: v22.71,41.76 v22.71,32.31 | v29.11,65.53 29.11,76.2 VIA2.30 | 101.8,52.73 101.8,62.33 102.87,63.4 RAM(ALL).15 | 101.8,52.73 101.8,47.55 94.18,39.93 94.18,36.12 92.81,34.75 89.61,34.75 87.63,36.73 ACIA.21 | AT28C256.15 102.87,90.07 107.29,85.65 107.29,85.04 107.75,84.58 109.73,84.58 110.03,84.89 110.95,84.89 111.56,84.28 111.56,72.24 110.8,71.48 110.8,53.19 110.34,52.73 101.8,52.73 | v30.48,19.66 29.26,20.88 29.26,21.49 65C02.30
D4  (via drill 0.35)
  Top 0.152: 21.34,26.98 26.67,21.64 65C02.29 | 21.34,26.98 15.85,26.98 15.09,27.74 15.09,38.25 v14.63,38.71 | v26.67,65.68 25.6,64.62 25.6,49.38 26.67,48.31 VIA1.29 | v88.09,51.36 86.56,49.84 86.56,47.24 88.24,45.57 88.24,40.54 85.19,37.49 85.19,36.88 ACIA.22 | v105.77,86.11 109.42,86.11 109.88,85.65 109.88,84.73 103.94,78.79 103.94,72.85 v101.96,70.87 | 21.34,26.98 21.34,28.19 v22.71,29.57
  Bottom 0.152: v14.63,38.71 15.85,38.71 23.62,46.48 24.99,46.48 26.67,48.16 VIA1.29 | v26.67,65.68 VIA2.29 | 100.28,63.55 v88.09,51.36 | v105.77,86.11 100.43,91.44 AT28C256.16 | 101.96,69.8 101.96,65.23 100.28,63.55 | 101.96,69.8 v101.96,70.87 | 100.28,63.55 RAM(ALL).16 | v22.71,29.57 51.51,29.57 61.72,39.78 61.72,49.99 73.46,61.72 80.31,61.72 81.53,62.94 81.53,64.77 86.56,69.8 101.96,69.8
D5  (via drill 0.35)
  Top 0.152: v13.41,45.72 13.41,43.43 12.65,42.67 12.65,29.26 15.54,26.36 18.9,26.36 23.62,21.64 24.08,21.64 65C02.28 | v24.23,66.9 24.23,65.53 25.15,64.62 25.15,49.23 24.23,48.31 VIA1.28 | v81.53,46.02 81.53,49.99 v82.91,51.36 81.53,52.73 81.53,76.81 78.49,79.86 v77.88,79.86
  Bottom 0.152: v13.41,45.72 21.64,45.72 24.08,48.16 VIA1.28 24.23,48.31 24.54,48.31 26.52,50.29 36.88,50.29 38.25,48.92 38.25,47.24 39.01,46.48 49.84,46.48 50.75,47.4 50.75,49.53 63.09,61.87 63.09,64.77 73.91,75.59 73.91,77.27 76.5,79.86 v77.88,79.86 84.73,86.72 92.35,86.72 92.96,86.11 94.94,86.11 97.69,88.85 97.69,91.44 AT28C256.17 | v24.23,66.9 24.23,76.2 VIA2.28 | v81.53,46.02 82.45,45.11 82.45,36.88 ACIA.23 | v82.91,51.36 85.65,51.36 RAM(ALL).17
D6  (via drill 0.35)
  Top 0.152: 80.01,36.73 80.47,36.73 82.14,35.05 v86.87,35.05 | v96.32,41 96.32,62.33 95.25,63.4 RAM(ALL).18 | v28.5,19.81 29.57,19.81 30.33,20.57 30.33,26.21 v29.87,26.67 21.79,34.75 21.03,34.75 20.27,35.51 20.27,46.94 VIA1.27 22.71,49.38 22.71,57.45 | v23.32,66.29 23.32,64.77 22.71,64.16 22.71,57.45 | AT28C256.18 90.53,86.72 v70.41,86.72 | 22.71,57.45 v23.47,57.45 | 80.01,36.73 79.55,36.73 73.15,30.33 60.35,30.33 56.69,26.67 v45.87,26.67 | 80.01,36.73 ACIA.24
  Bottom 0.152: v86.87,35.05 88.85,35.05 89.46,34.44 94.94,34.44 96.32,35.81 v96.32,41 | v28.5,19.81 23.77,19.81 22.1,21.49 21.64,21.49 65C02.27 | v23.32,66.29 21.64,67.97 21.64,76.2 VIA2.27 | v70.41,86.72 70.41,86.26 59.44,75.29 59.44,64.62 52.27,57.45 v23.47,57.45 | v29.87,26.67 v45.87,26.67
D7  (via drill 0.35)
  Top 0.152: v87.48,40.84 81.84,40.84 77.88,36.88 77.57,36.88 ACIA.25 77.42,36.73 76.96,36.73 70.87,30.63 59.44,30.63 59.28,30.79 45.11,30.79 v37.95,23.62 | v92.81,46.18 93.73,47.09 93.73,49.38 90.83,52.27 90.83,61.57 92.66,63.4 RAM(ALL).19 | 65C02.26 19.05,21.49 19.51,21.49 21.18,19.81 24.54,19.81 25.15,20.42 25.15,22.71 21.18,26.67 15.7,26.67 12.95,29.41 12.95,42.52 14.17,43.74 14.17,46.02 13.72,46.48 13.56,46.48 12.95,47.09 12.95,49.38 13.56,49.99 17.37,49.99 19.05,48.31 VIA1.26 | v17.98,55.93 17.98,64.62 19.05,65.68 VIA2.26 20.73,77.88 41.15,77.88 43.13,79.86 48.16,79.86 62.03,93.73 63.7,93.73 66.14,96.16 77.88,96.16 79.1,94.94 88.85,94.94 92.35,91.44 AT28C256.19
  Bottom 0.152: v92.81,46.18 v87.48,40.84 | v17.98,55.93 17.98,49.38 19.05,48.31 VIA1.26 | v37.95,23.62 21.03,23.62 19.05,21.64 65C02.26
DCDB
  Top 0.152: J3.1 156.21,87.63 156.21,84.12 129.08,57 112.47,57 109.27,53.8 109.27,52.12 100.43,43.28 100.43,36.88 ACIA.16
DSRB
  Top 0.152: ACIA.17 97.84,36.88 97.84,41.15 108.97,52.27 108.97,53.95 112.32,57.3 128.93,57.3 154.84,83.21 154.84,86.26 ACIA-IO.1
DTRB
  Bottom 0.152: ACIA-IO.3 148.59,87.63 139.14,87.63 138.38,86.87 138.38,85.8 121.46,68.89 121.46,44.96 117.2,40.69 114.76,40.69 95.71,21.64 95.25,21.64 ACIA.11
GND  (via drill 0.35)
  Top 0.152: ACIA-IO.4 147.37,86.41 147.37,88.85 J3.4 | J3.7 ACIA-IO.6 142.34,86.41 144.78,88.85 J3.5 144.78,89 147.22,89 J3.4 | ACIA-IO.2 J3.2 152.4,89 | 154.84,91.44 154.84,96.47 TM.1 | 152.4,89 154.84,91.44 | 152.4,89 151.18,90.22 149.35,90.22 148.13,89 147.37,89 J3.4 | SN76489.6 156.21,18.14 154.53,19.81 154.53,21.18 SN76489.8 | C8.1 151.18,26.67 153.62,29.11 C9.2 153.77,29.26 153.77,43.89 | 153.77,43.89 157.43,43.89 J2.MP4 | 153.77,43.89 153.47,43.89 | 153.47,43.89 152.09,43.89 J2.MP1 | 151.94,50.9 151.94,52.58 J2.MP2 152.09,52.73 152.55,52.73 154.99,55.17 | 151.94,50.9 151.94,49.99 J2.5 151.94,49.84 153.01,49.84 153.47,49.38 153.47,43.89 | 154.99,55.17 154.99,62.18 SERCLCK.7 154.99,62.33 156.51,63.86 156.51,89.76 154.84,91.44 | 154.99,55.17 157.43,52.73 J2.MP3 | 151.94,50.9 143.56,50.9 POWER.2 | ATTINY26.6 137.16,15.24 ATTINY26.16 125.73,15.24 ADDR.7 120.55,20.42 120.55,21.64 118.11,24.08 C11.2 118.11,30.48 C1.- | 112.17,57.61 102.87,48.31 RAM(ALL).14 | 112.17,57.61 123.6,57.61 128.17,62.18 6502CLCK.7 | 112.17,57.61 v108.97,60.81 | SNCLCK.7 134.57,36.88 134.57,31.85 C10.1 | 59.74,50.6 59.74,49.53 C3.2 | 59.74,50.6 64.77,55.63 C6.1 | 59.74,50.6 54.71,55.63 54.71,63.4 VIA1.1 | 65C02.21 6.4,21.49 6.4,11.43 7.62,10.21 PWR.K | C2.2 68.58,22.86 ACIA.1 | RES.4 60.35,9.6 62.18,7.77 68.43,7.77 69.34,8.69 KBD.3 | C5.2 v59.74,39.32
  Bottom 0.152: SN76489.8 154.99,22.86 151.18,26.67 C8.1 | C1.- 128.17,40.54 128.17,43.13 SNCLCK.7 128.32,43.28 129.24,44.2 129.24,51.21 128.32,52.12 128.32,62.18 6502CLCK.7 | v108.97,60.81 108.97,69.04 102.87,75.13 AT28C256.14 102.41,76.2 99.36,79.25 78.33,79.25 76.05,76.96 76.05,74.52 63.4,61.87 63.4,59.89 64.77,58.52 C6.1 | C10.1 135.48,32.61 135.48,42.52 143.41,50.44 143.41,50.75 POWER.2 | VIA2.1 59.74,91.44 64.77,86.41 C7.1 64.77,83.67 59.74,78.64 59.74,77.57 C4.2 59.59,77.42 58.83,76.66 58.83,65.68 56.69,63.55 54.71,63.55 VIA1.1 | RES.4 46.79,9.6 46.79,3.2 RES.3 46.63,3.05 44.81,1.22 21.49,1.22 12.65,10.06 7.62,10.06 PWR.K | C5.2 64.77,33.22 58.67,27.13 58.67,23.77 59.59,22.86 C2.2 | ACIA.1 70.56,20.88 70.56,10.82 69.49,9.75 69.49,8.84 KBD.3 | v59.74,39.32 59.74,49.53 C3.2
GPIO0
  Top 0.152: VIA1.2 60.05,71.48 61.27,71.48 65.68,75.89 65.68,77.72 69.65,81.69 70.26,81.69 72.54,83.97 102.11,83.97 107.29,89.15 116.89,89.15 117.81,90.07 124.36,90.07 GPIO.1
GPIO1
  Top 0.152: VIA1.3 49.53,63.55 49.99,63.55 58.22,71.78 61.11,71.78 65.38,76.05 65.38,77.88 69.49,81.99 70.1,81.99 72.39,84.28 101.96,84.28 107.14,89.46 116.74,89.46 117.65,90.37 122.07,90.37 128.17,96.47 GPIO.2
GPIO2  (via drill 0.35)
  Top 0.152: v58.06,74.52 60.66,74.52 v69.49,83.36 | v93.27,87.33 93.57,87.33 95.25,89 104.85,89 v108.2,92.35 | v122.83,93.57 125.73,96.47 GPIO.3
  Bottom 0.152: v58.06,74.52 47.09,63.55 VIA1.4 | v69.49,83.36 79.55,83.36 83.52,87.33 v93.27,87.33 | v108.2,92.35 109.88,92.35 111.1,93.57 v122.83,93.57
GPIO3
  Top 0.152: GPIO.4 121.92,95.25 120.4,95.25 114.91,89.76 106.98,89.76 101.8,84.58 72.24,84.58 69.95,82.3 69.34,82.3 65.08,78.03 65.08,76.2 60.96,72.08 58.06,72.08 51.21,65.23 46.63,65.23 44.96,63.55 44.5,63.55 VIA1.5
GPIO4  (via drill 0.35)
  Top 0.152: v50.9,65.99 44.81,65.99 42.37,63.55 41.91,63.55 VIA1.6 | v69.04,65.99 v58.06,65.99 | v104.39,71.17 109.42,71.17 132.13,93.88 132.13,97.54 131.83,97.84 121.92,97.84 120.7,96.62 GPIO.5
  Bottom 0.152: v58.06,65.99 v50.9,65.99 | v69.04,65.99 71.93,65.99 81.53,75.59 81.53,77.27 82.91,78.64 92.35,78.64 94.18,76.81 94.18,75.13 97.69,71.63 103.94,71.63 v104.39,71.17
GPIO5
  Top 0.152: GPIO.6 118.11,96.01 112.17,90.07 106.83,90.07 101.65,84.89 72.08,84.89 69.8,82.6 69.19,82.6 64.77,78.18 64.77,76.35 60.81,72.39 48.62,72.39 39.78,63.55 39.47,63.55 VIA1.7
GPIO6
  Top 0.152: VIA1.8 36.88,63.55 36.88,66.45 45.87,75.44 45.87,77.27 47.55,78.94 64.01,78.94 70.26,85.19 101.5,85.19 106.68,90.37 112.01,90.37 115.52,93.88 115.52,96.47 GPIO.7
GPIO7  (via drill 0.35)
  Top 0.152: v40.84,78.64 41.45,78.64 52.27,89.46 57.3,89.46 65.53,97.69 111.86,97.69 GPIO.8
  Bottom 0.152: VIA1.9 34.29,67.06 40.84,73.61 v40.84,78.64
IOCSB
  Top 0.152: VIA2.23 13.11,77.88 14.48,77.88 15.09,77.27 15.09,75.13 12.95,73 12.95,62.94 11.43,61.42 VIA1.23 11.43,44.04 5.33,37.95 5.33,31.7 12.95,24.08 12.95,20.42 15.09,18.29 71.63,18.29 ACIA.3 74.98,21.49 75.44,21.49 77.11,19.81 112.47,19.81 112.93,20.27 ADDR.8
IRQB  (via drill 0.35)
  Top 0.152: 65C02.4 50.6,33.22 71.32,33.22 ACIA.26 | 6.55,76.05 6.4,76.2 VIA2.21 6.55,76.05 | 6.55,76.05 7.47,75.13 7.47,56.39 6.4,55.32 6.4,48.31 VIA1.21 | R1.1 110.19,91.44 106.38,95.25 79.25,95.25 78.03,96.47 65.38,96.47 v63.7,94.79 | v32.61,89.46 19.96,89.46 6.55,76.05
  Bottom 0.152: v63.7,94.79 45.72,94.79 43.43,92.51 43.43,90.37 42.52,89.46 v32.61,89.46 | 65C02.4 46.94,36.73 46.48,36.73 44.81,35.05 31.39,35.05 30.33,36.12 30.33,37.8 25.6,42.52 20.12,42.52 15.09,37.49 15.09,35.81 14.33,35.05 11.12,35.05 9.91,36.27 9.91,44.65 6.4,48.16 VIA1.21
KBCLK  (via drill 0.35)
  Top 0.152: ATTINY26.4 139.75,12.65 144.02,12.65 147.52,9.14 149.66,9.14 150.27,9.75 150.27,10.67 149.35,11.58 147.52,11.58 146.46,12.65 146.46,30.02 140.97,35.51 R7.1 | v81.08,11.43 69.49,11.43 KBD.6
  Bottom 0.152: v81.08,11.43 90.98,11.43 93.73,8.69 93.73,8.23 95.71,6.25 109.73,6.25 112.01,3.96 128.78,3.96 131.37,6.55 133.5,6.55 139.6,12.65 ATTINY26.4
KBDATA
  Top 0.152: ATTINY26.7 141.43,18.59 141.43,17.37 140.82,16.76 139.14,16.76 136.55,14.17 131.37,14.17 126.34,9.14 119.48,9.14 114.91,13.72 84.43,13.72 80.92,10.21 69.34,10.21 67.97,8.84 67.36,8.84 KBD.1
  Bottom 0.152: R8.1 136.09,33.22 136.09,24.38 139.6,20.88 139.6,20.42 ATTINY26.7
KBHND  (via drill 0.35)
  Top 0.152: ATTINY26.8 139.75,22.86 139.75,25.3 ATTINY26.9 139.6,25.45 139.6,25.91 137.92,27.58 137.92,31.09 138.23,31.39 138.23,32.16 137.62,32.77 136.7,32.77 135.64,31.7 135.64,31.24 135.03,30.63 v126.64,30.63 | v50.9,56.69 53.03,56.69 58.67,51.05 58.67,49.07 63.4,44.35 69.34,44.35 70.56,43.13 73.46,43.13 v74.68,44.35
  Bottom 0.152: v50.9,56.69 23.16,56.69 22.71,57.15 22.71,57.76 24.08,59.13 24.08,63.4 VIA1.13 | v74.68,44.35 81.53,37.49 81.53,29.87 89.15,22.25 89.15,20.42 90.07,19.51 104.7,19.51 118.11,32.92 | v126.64,30.63 120.4,30.63 118.11,32.92 | 118.11,32.92 C1.+
N$1  (via drill 0.35)
  Top 0.152: v86.87,28.04 60.35,28.04 58.37,26.06 49.38,26.06 44.96,21.64 44.5,21.64 65C02.36 | v116.28,84.28 117.04,84.28 120.4,87.63 R4.1
  Bottom 0.152: v86.87,28.04 89,28.04 96.77,35.81 96.77,38.71 111.4,53.34 111.4,71.63 112.01,72.24 112.01,80.01 v116.28,84.28
N$2
  Top 0.152: R9.2 17.98,7.62 16.92,6.55 8.69,6.55 PWR.A
N$3  (via drill 0.35)
  Top 0.152: v118.87,89.31 117.5,89.31 112.32,84.12 112.32,80.16 102.26,70.1 93.73,70.1 90.68,67.06 89,67.06 86.56,64.62 86.56,62.33 86.26,62.03 86.26,47.24 81.23,42.22 64.16,42.22 63.25,41.3 57,41.3 52.58,36.88 52.12,36.88 65C02.2
  Bottom 0.152: v118.87,89.31 118.87,89.76 120.55,91.44 R2.1
N$4  (via drill 0.35)
  Top 0.152: v70.87,43.89 73.46,46.48 75.29,46.48 76.35,47.55 76.35,54.86 v76.96,55.47 | v86.87,69.04 86.87,70.71 91.59,75.44 91.59,77.27 97.99,83.67 102.26,83.67 106.22,87.63 R3.1
  Bottom 0.152: v70.87,43.89 53.49,26.52 53.49,20.88 52.43,19.81 51.66,19.81 49.99,21.49 49.53,21.49 65C02.38 | v76.96,55.47 79.25,55.47 86.56,62.79 86.56,68.73 v86.87,69.04
N$5
  Top 0.152: 95.25,3.66 90.07,8.84 J1.MH3 | 95.25,3.66 J1.MH1 95.25,3.5 | 95.25,3.66 100.43,8.84 J1.MH2
NMIB  (via drill 0.35)
  Top 0.152: v55.63,46.02 55.63,53.03 v54.41,54.25
  Bottom 0.152: v55.63,46.02 55.02,46.02 51.21,42.22 47.7,42.22 42.37,36.88 41.91,36.88 65C02.6 | v54.41,54.25 54.41,58.22 62.79,66.6 62.79,71.32 71.93,80.47 77.11,80.47 83.67,87.02 92.51,87.02 93.12,86.41 94.79,86.41 96.77,88.39 96.77,92.51 97.38,93.12 98.3,93.12 99.21,92.2 99.21,90.37 105.77,83.82 R5.1
PHI2  (via drill 0.35)
  Top 0.152: v16.46,56.54 16.46,61.42 15.39,62.48 15.39,75.13 16.46,76.2 VIA2.25 | v62.03,26.21 60.2,24.38 59.74,24.38 55.17,19.81 54.25,19.81 52.58,21.49 52.12,21.49 65C02.39 | v83.97,12.19 104.24,12.19 104.85,11.58 113.69,11.58 120.09,5.18 120.55,5.18 ADDR.1 | v28.19,25.15 17.98,35.36 17.98,37.49 16.61,38.86 16.61,48.16 VIA1.25
  Bottom 0.152: v16.46,56.54 16.46,48.31 VIA1.25 | 64.77,28.96 72.39,36.58 ACIA.27 | 64.77,28.96 v62.03,26.21 | v83.97,12.19 79.7,12.19 70.87,21.03 70.87,22.86 64.77,28.96 | v28.19,25.15 48.46,25.15 51.97,21.64 65C02.39
RAMCSB
  Top 0.152: RAM(ALL).20 90.22,63.4 90.22,50.29 91.29,49.23 91.29,34.9 102.87,23.32 112.17,23.32 115.37,20.12 115.37,15.39 120.55,10.21 ADDR.3
RES  (via drill 0.35)
  Top 0.152: v119.94,56.24 119.94,53.65 139.6,33.98 139.6,28.04 ATTINY26.10 139.75,27.89 139.75,27.43 141.43,25.76 141.43,22.4 140.36,21.34 v136.7,21.34 | v39.32,55.17 39.32,58.83 35.81,62.33 35.81,68.89 | v35.81,72.69 35.81,68.89 | ACIA.4 72.08,26.98 59.74,26.98 54.71,21.95 54.71,21.64 65C02.40 | RES.2 44.35,9.6 46.79,12.04 v48.77,12.04 | 35.81,68.89 31.39,68.89 27.89,65.38 v27.89,49.53 | v30.63,38.56 30.63,20.57 31.39,19.81 32.46,19.81 v32.92,20.27
  Bottom 0.152: v119.94,56.24 119.94,83.21 120.55,83.82 R6.1 | v39.32,55.17 39.32,48.31 VIA1.34 | v35.81,72.69 39.32,76.2 VIA2.34 | RES.1 42.22,3.2 42.22,9.6 RES.2 42.06,9.6 32.92,18.75 v32.92,20.27 | v48.77,12.04 48.77,15.7 54.56,21.49 65C02.40 | v27.89,49.53 27.89,41.3 v30.63,38.56 | v136.7,21.34 111.71,21.34 108.05,17.68 90.22,17.68 87.02,14.48 84.58,14.48 ACIA.4
ROMOE/CE  (via drill 0.35)
  Top 0.152: AT28C256.22 85.5,91.44 87.17,93.12 88.39,93.12 90.07,91.44 AT28C256.20 | v94.49,87.17 95.71,85.95 v95.86,85.95 | v116.89,62.79 v109.73,69.95 | v116.89,41.45 116.89,21.49 120.55,17.83 ADDR.6
  Bottom 0.152: ADDR.2 120.7,7.62 120.7,8.08 122.38,9.75 122.38,16 120.7,17.68 ADDR.6 120.55,17.83 113.08,17.83 ADDR.9 | v94.49,87.17 90.22,91.44 AT28C256.20 | v95.86,85.95 98.3,83.52 98.3,83.36 109.73,71.93 v109.73,69.95 | v116.89,41.45 v116.89,62.79
RTSB
  Top 0.152: ACIA.8 87.63,34.29 88.85,35.51 88.85,64.77 93.88,69.8 108.51,69.8 120.55,81.84 140.36,81.84 144.78,86.26 ACIA-IO.5
RWB  (via drill 0.35)
  Top 0.152: v58.98,30.02 48.16,30.02 39.78,21.64 39.47,21.64 65C02.34 | RAM(ALL).27 72.39,56.54 73.46,55.47 v73.46,50.9 | VIA2.22 8.99,76.2 9.91,75.29 9.91,62.33 8.99,61.42 8.99,48.31 VIA1.22 8.84,48.16 v4.57,43.89 | AT28C256.27 71.93,91.44 70.26,93.12 62.33,93.12 48.46,79.25 44.35,79.25 v43.74,78.64
  Bottom 0.152: v58.98,30.02 65.68,36.73 69.8,36.73 ACIA.28 69.95,36.88 73.46,40.39 v73.46,50.9 | v43.74,78.64 41.91,78.64 41.15,79.4 12.19,79.4 8.99,76.2 VIA2.22 | v4.57,43.89 4.57,21.18 9.75,16 27.89,16 31.24,19.36 31.24,19.96 30.63,20.57 30.63,22.55 31.39,23.32 37.19,23.32 38.86,21.64 39.32,21.64 65C02.34
RX
  Bottom 0.152: ACIA-IO.7 121.77,68.43 121.77,44.81 117.35,40.39 117.04,40.39 98.3,21.64 97.84,21.64 ACIA.12
SERCLK
  Top 0.152: SERCLCK.8 154.84,69.8 154.84,68.58 137.16,50.9 CLKMODE.2
  Bottom 0.152: ACIA.6 82.6,21.49 83.06,21.49 86.26,18.29 108.2,18.29 119.48,29.57 127.1,29.57 135.18,37.64 135.18,43.89 138.38,47.09 138.38,49.53 137.16,50.75 CLKMODE.2
SNCLK
  Top 0.152: SNCLCK.8 128.32,50.75 128.32,46.79 146.15,28.96 146.15,12.5 148.59,10.06 SN76489.14
SNOUT
  Bottom 0.152: 150.11,26.52 150.11,28.19 C9.1 | 150.11,26.52 150.11,26.21 155.91,20.42 156.21,20.42 SN76489.7 | 150.11,26.52 142.8,19.2 112.32,19.2 110.49,17.37 105.46,17.37 97.08,8.99 95.25,8.99 J1.1
SNWE
  Bottom 0.152: SN76489.5 154.53,13.56 154.53,8.38 149.81,3.66 111.86,3.66 109.58,5.94 89.46,5.94 87.48,7.92 71.93,7.92 71.78,7.77 62.18,7.77 62.03,7.92 51.82,7.92 40.84,18.9 40.84,22.25 38.71,24.38 17.22,24.38 15.39,22.55 15.39,20.88 14.33,19.81 8.53,19.81 7.77,20.57 7.77,22.25 5.33,24.69 5.33,49.38 5.94,49.99 7.62,49.99 20.12,62.48 20.12,64.16 21.49,65.53 24.69,65.53 26.67,63.55 VIA1.12
TX
  Top 0.152: TM.8 137.16,90.68 135.94,89.46 135.94,87.63 137.16,86.41 ACIA-IO.8
  Bottom 0.152: ACIA.10 92.81,21.64 92.81,24.69 111.71,43.59 111.71,71.48 112.32,72.08 112.32,79.25 117.04,83.97 117.04,84.28 118.26,85.5 136.4,85.5 137.16,86.26 ACIA-IO.8
V2KB0  (via drill 0.35)
  Top 0.152: v157.58,96.62 155.3,98.91 41.76,98.91 35.51,92.66 35.51,90.22 36.27,89.46 44.65,89.46 45.87,90.68 45.87,92.51 46.48,93.12 50.29,93.12 51.97,91.44 VIA2.2
  Bottom 0.152: v157.58,96.62 158.8,95.4 158.8,18.29 157.28,16.76 155.6,16.76 154.23,15.39 154.23,8.53 149.66,3.96 138.68,3.96 137.62,5.03 132.13,5.03 ATTINY26.20
V2KB1  (via drill 0.35)
  Top 0.152: v125.58,14.02 124.66,14.02 121.92,16.76 119.48,16.76 116.59,19.66 116.59,40.69 114,43.28 v114,48.46 | v113.08,83.52 v113.08,78.94
  Bottom 0.152: v125.58,14.02 131.98,7.62 ATTINY26.19 | v114,48.46 112.01,50.44 112.01,71.32 113.08,72.39 v113.08,78.94 | v113.08,83.52 104.55,92.05 104.55,92.81 103.33,94.03 75.74,94.03 75.44,93.73 51.82,93.73 VIA2.3
V2KB2  (via drill 0.35)
  Top 0.152: v120.7,53.95 141.73,32.92 141.73,15.09 140.82,14.17 138.99,14.17 135.03,10.21 132.13,10.21 ATTINY26.18 | v125.58,86.26 v123.44,84.12 | v111.86,91.29 111.86,91.59 107.9,95.56 80.01,95.56 v78.64,96.93 | v62.18,96.93 55.02,89.76 48.77,89.76 47.09,91.44 VIA2.4
  Bottom 0.152: v120.7,53.95 120.7,81.38 v123.44,84.12 | v125.58,86.26 116.89,86.26 v111.86,91.29 | v62.18,96.93 v78.64,96.93
V2KB3  (via drill 0.35)
  Top 0.152: v154.84,27.43 154.84,23.62 154.08,22.86 154.08,13.11 149.81,8.84 131.22,8.84 130.3,9.75 130.3,10.97 131.98,12.65 ATTINY26.17
  Bottom 0.152: VIA2.5 44.81,91.44 47.4,94.03 75.29,94.03 75.59,94.34 128.78,94.34 132.89,90.22 147.83,90.22 148.59,89.46 148.59,88.39 149.35,87.63 150.42,87.63 151.18,86.87 151.18,71.02 157.89,64.31 157.89,30.48 v154.84,27.43
V2KB4  (via drill 0.35)
  Top 0.152: v105.31,96.32 108.2,96.32 v112.17,92.35 | v116.74,87.48 116.74,85.8 115.52,84.58 v115.52,78.33 | v115.52,50.75 115.52,50.14 119.94,45.72 119.94,35.81 130.3,25.45 130.3,22.1 ATTINY26.14
  Bottom 0.152: VIA2.6 41.91,91.9 46.18,96.16 105.16,96.16 v105.31,96.32 | v112.17,92.35 112.17,92.05 v116.74,87.48 | v115.52,50.75 v115.52,78.33
V2KB5  (via drill 0.35)
  Top 0.152: VIA2.7 39.01,91.44 37.34,89.76 36.42,89.76 35.81,90.37 35.81,92.51 41.91,98.6 155.14,98.6 156.82,96.93 156.82,55.32 v156.36,54.86
  Bottom 0.152: v156.36,54.86 156.36,51.21 144.32,39.17 140.51,39.17 135.79,34.44 135.79,26.52 132.13,22.86 ATTINY26.13
V2KB6  (via drill 0.35)
  Top 0.152: VIA2.8 37.19,91.44 43.74,97.99 113.39,97.99 114.3,97.08 114.3,93.73 v113.39,92.81 | v124.82,89.46 119.18,83.82 v119.18,81.99 | v120.7,45.26 120.7,35.51 130.76,25.45 131.98,25.45 ATTINY26.12
  Bottom 0.152: v113.39,92.81 121.46,92.81 v124.82,89.46 | v119.18,81.99 119.18,46.79 v120.7,45.26
V2KB7  (via drill 0.35)
  Top 0.152: v75.89,95.1 78.94,92.05 78.94,90.37 79.55,89.76 93.12,89.76 94.18,90.83 94.18,92.51 94.79,93.12 95.71,93.12 96.77,92.05 96.77,90.37 97.38,89.76 v98.6,89.76 | v110.03,53.49 111.71,53.49 119.63,45.57 119.63,35.66 130,25.3 130,20.27 131.06,19.2 133.04,19.2 133.81,19.96 133.81,26.21 ATTINY26.11
  Bottom 0.152: VIA2.9 34.75,91.44 36.42,89.76 42.37,89.76 43.13,90.53 43.13,92.66 46.02,95.56 75.44,95.56 v75.89,95.1 | v98.6,89.76 98.6,83.52 110.49,71.63 110.49,53.95 v110.03,53.49
V2SN0  (via drill 0.35)
  Top 0.152: v63.4,86.26 64.31,85.34 69.95,85.34 70.56,85.95 v92.05,85.95 | v109.73,68.89 119.94,58.67 v122.53,58.67 | v127.56,53.65 127.56,53.03 146.91,33.68 146.91,22.1 148.59,20.42 SN76489.10
  Bottom 0.152: v63.4,86.26 34.75,86.26 31.85,89.15 31.85,91.44 VIA2.10 | v92.05,85.95 92.66,85.95 99.06,79.55 101.65,79.55 108.97,72.24 108.97,69.65 v109.73,68.89 | v127.56,53.65 v122.53,58.67
V2SN1  (via drill 0.35)
  Top 0.152: SN76489.11 148.59,18.14 150.27,19.81 150.27,26.06 150.11,26.21 v150.11,46.02 | v134.42,86.26 v138.07,82.6 | v134.57,88.24 134.57,95.56 131.83,98.3 42.67,98.3 v37.64,93.27
  Bottom 0.152: v150.11,46.02 150.11,70.56 v138.07,82.6 | v134.42,86.26 134.42,88.09 v134.57,88.24 | v37.64,93.27 31.09,93.27 29.26,91.44 VIA2.11
V2SN2  (via drill 0.35)
  Top 0.152: v123.14,14.48 123.14,14.94 121.61,16.46 119.33,16.46 115.67,20.12 115.67,20.27 100.89,35.05 94.94,35.05 93.73,36.27 93.73,43.59 v92.66,44.65 | v70.41,56.08 65.84,60.66 65.84,61.42 64.62,62.64 v55.93,62.64 | v38.41,85.19 32.77,90.83 32.77,92.51 32.16,93.12 28.35,93.12 VIA2.12
  Bottom 0.152: SN76489.12 144.32,15.24 140.66,18.9 127.56,18.9 v123.14,14.48 | v92.66,44.65 92.66,44.96 93.73,46.02 93.73,49.38 92.81,50.29 81.08,50.29 75.29,56.08 v70.41,56.08 | v55.93,62.64 55.02,61.72 46.63,61.72 45.57,62.79 45.57,78.03 v38.41,85.19
V2SN3  (via drill 0.35)
  Top 0.152: SN76489.13 148.59,13.11 153.77,18.29 v153.77,25.3
  Bottom 0.152: v153.77,25.3 158.19,29.72 158.19,80.77 153.62,85.34 153.62,86.87 152.86,87.63 151.94,87.63 151.18,88.39 151.18,89.31 147.22,93.27 130.3,93.27 128.63,94.94 107.75,94.94 105,97.69 30.48,97.69 24.23,91.44 VIA2.13
V2SN4  (via drill 0.35)
  Top 0.152: v19.66,98.15 19.66,93.27 21.49,91.44 VIA2.14
  Bottom 0.152: SN76489.15 148.59,8.08 153.92,13.41 153.92,17.68 155.45,19.2 157.28,19.2 158.5,20.42 158.5,85.19 156.06,87.63 153.92,87.63 153.62,87.94 153.62,89.46 147.83,95.25 134.42,95.25 131.37,98.3 19.81,98.3 v19.66,98.15
V2SN5
  Top 0.152: VIA2.15 17.37,93.12 5.94,93.12 3.5,90.68 3.5,10.21 7.47,6.25 45.87,6.25 49.23,2.9 80.47,2.9 89,11.43 101.5,11.43 109.27,3.66 152.71,3.66 154.08,5.03 156.21,5.03 SN76489.1
V2SN6  (via drill 0.35)
  Top 0.152: v40.69,8.69 41.76,7.62 58.06,7.62 58.37,7.92 61.57,7.92 62.03,7.47 71.48,7.47 73.91,9.91 87.02,9.91 88.85,11.73 104.24,11.73 112.01,3.96 152.55,3.96 SN76489.2
  Bottom 0.152: VIA2.16 16.15,91.44 14.48,89.76 10.97,89.76 9.91,90.83 9.91,92.51 9.3,93.12 5.94,93.12 3.81,90.98 3.81,21.49 16.61,8.69 v40.69,8.69
V2SN7  (via drill 0.35)
  Top 0.152: SN76489.3 156.21,10.52 157.89,12.19 157.89,41.3 v157.12,42.06 | v138.07,83.67 132.89,88.85 v132.89,94.03
  Bottom 0.152: v157.12,42.06 157.12,64.62 v138.07,83.67 | v132.89,94.03 130,94.03 128.78,95.25 107.9,95.25 105.16,97.99 20.57,97.99 14.02,91.44 VIA2.17

### Text on the board
tPlace: 5V | GND | 5V | GND | GND | CTSB | GND | DCDB | TX | RX | GND | RTSB | GND | DTRB | GND | DSRB | - | + | MintSpark Electronics 2021 | SmartBread 6502 1.0